# Altium project PUA.PrjPcb (part 12 of 14)

## Sheet Server_CPU_USB.SchDoc
size D
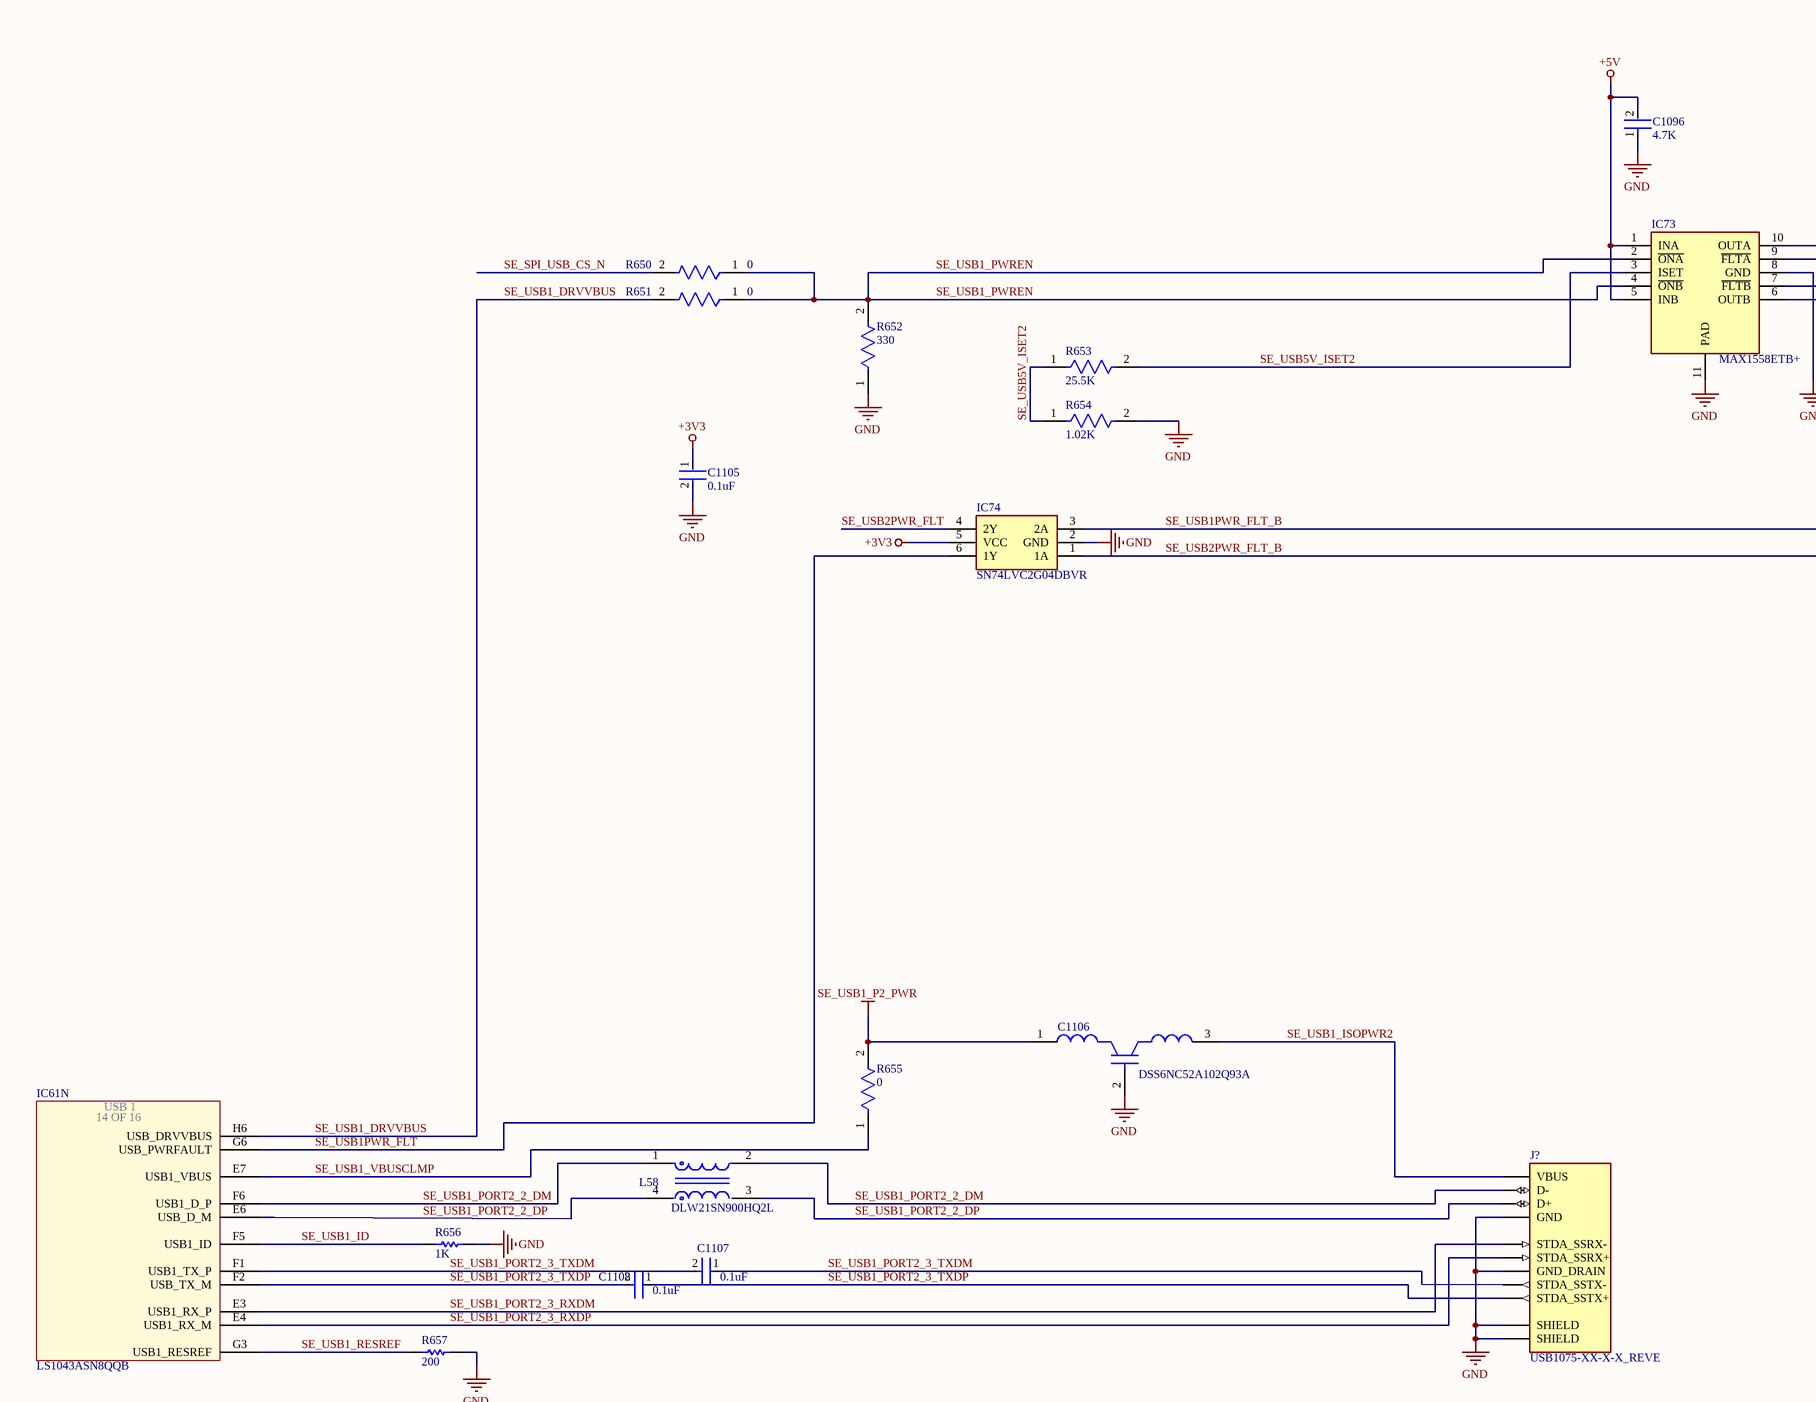
[diagram p55: Server_CPU_USB.SchDoc, top left]
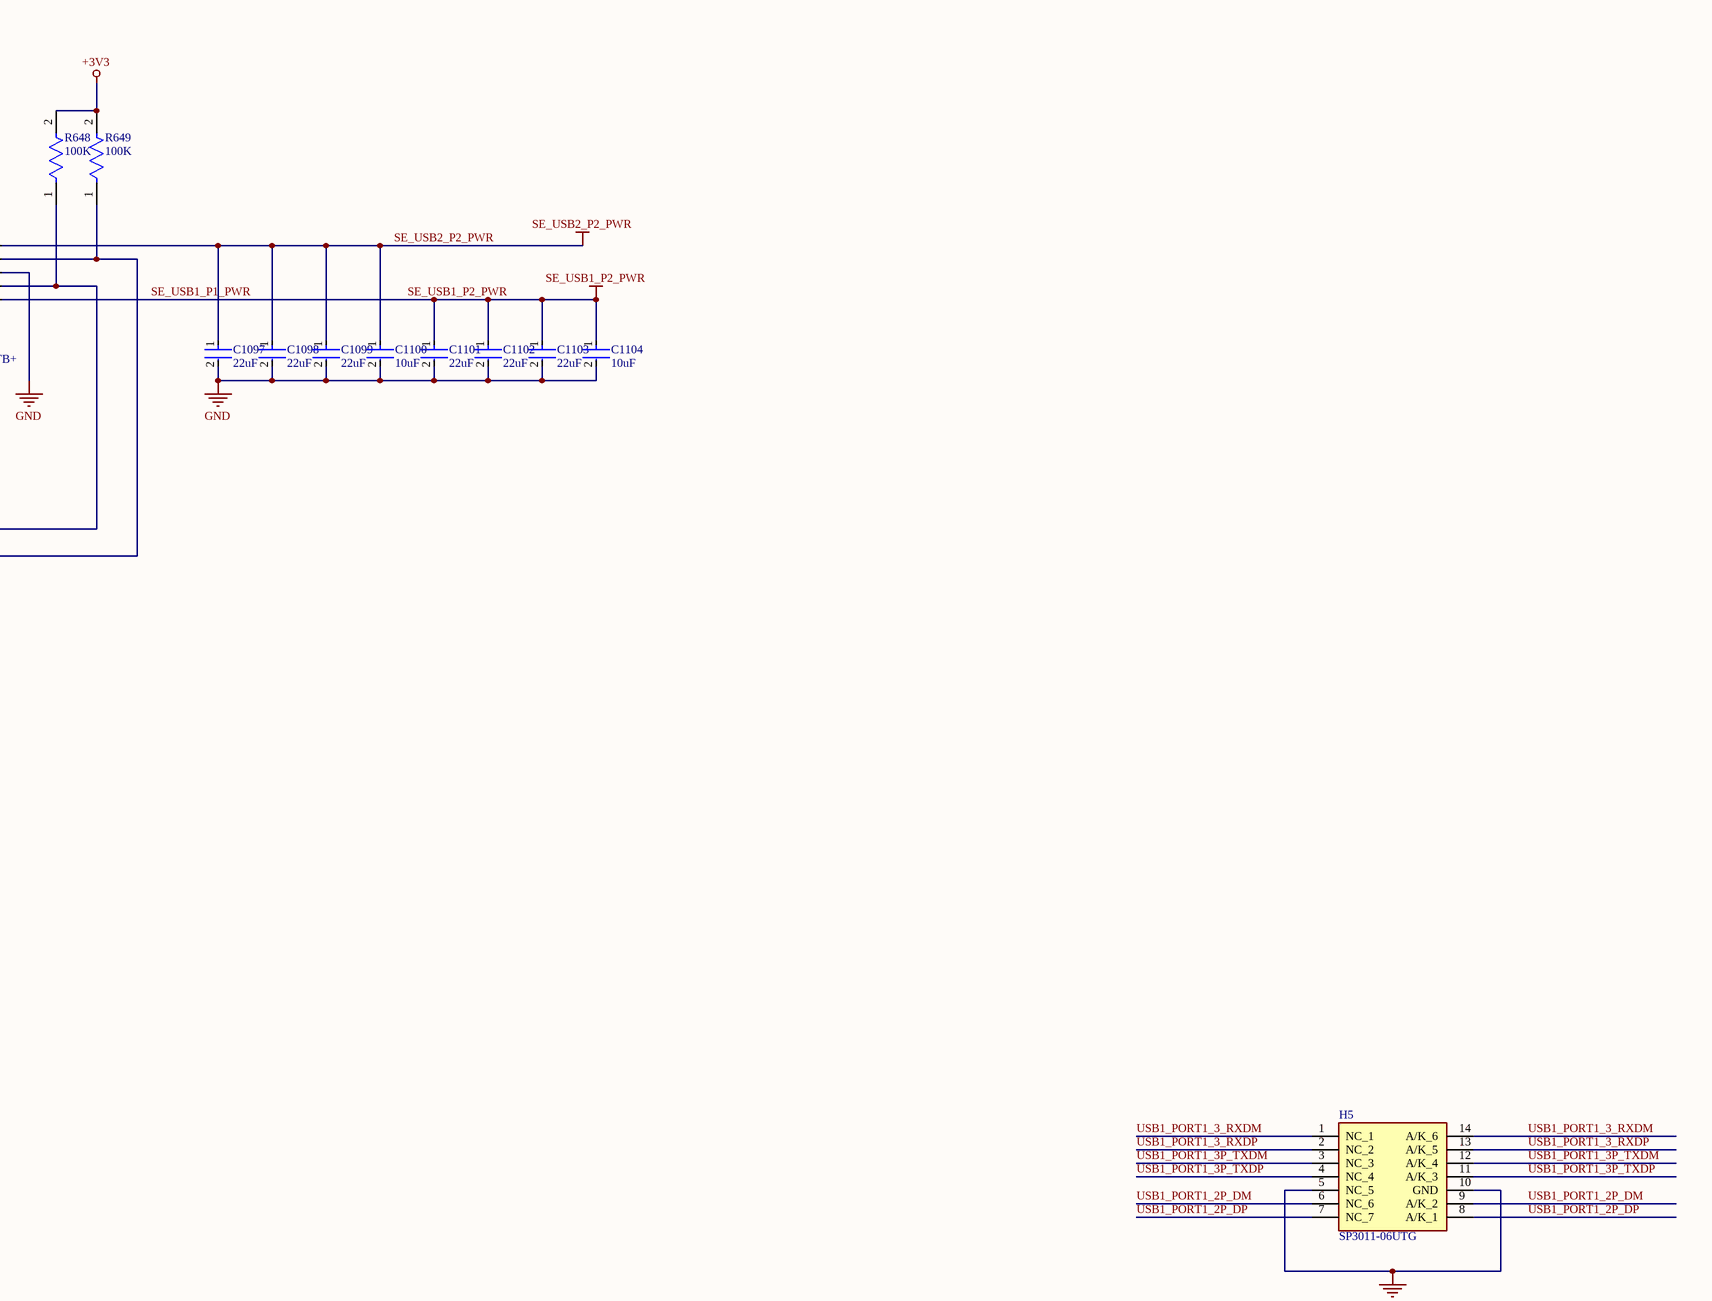
[diagram p56: Server_CPU_USB.SchDoc, top right]
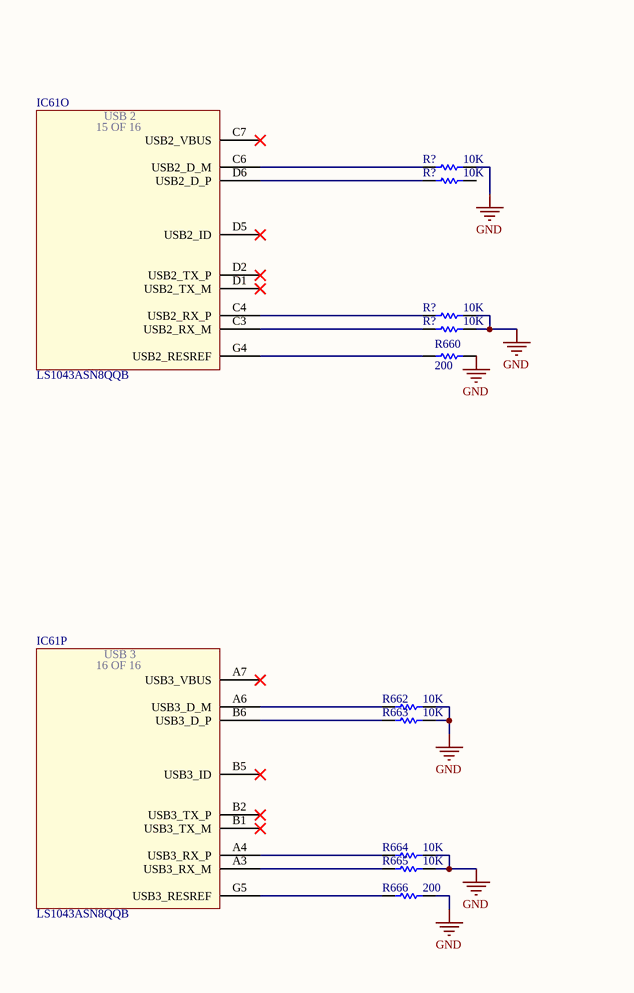
[diagram p57: Server_CPU_USB.SchDoc, bottom left]
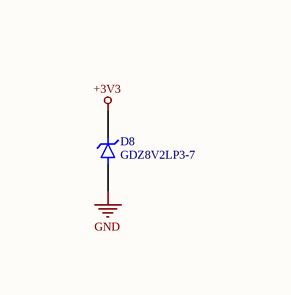
[diagram p58: Server_CPU_USB.SchDoc, bottom right]

### Parts
(Parts that share a designator on the sheet are numbered #1, #2 ... from top to bottom, then left to right.)
C1096  4.7K  [FP-GRM155-0_1-IPC_B]
C1097  22uF  [FP-GRM21B-0_15-MFG]
C1098  22uF  [FP-GRM21B-0_15-MFG]
C1099  22uF  [FP-GRM21B-0_15-MFG]
C1100  10uF  [FP-C0805C-DG-MFG]
C1101  22uF  [FP-GRM21B-0_15-MFG]
C1102  22uF  [FP-GRM21B-0_15-MFG]
C1103  22uF  [FP-GRM21B-0_15-MFG]
C1104  10uF  [FP-C0805C-DG-MFG]
C1105  0.1uF  [FP-GRM15-MFG]
C1106  DSS6NC52A102Q93A  [FP-DSS6N_Q-MFG]
C1107  0.1uF  [FP-GRM15-MFG]
C1108  0.1uF  [FP-GRM15-MFG]
D8  GDZ8V2LP3-7  [DIODFN2_62X32X35L19X24N]
H5  SP3011-06UTG  [SON50P135X350X55-14N]
IC61  LS1043ASN8QQB  [BGA780C80P28X28_2300X2300X261]  (parts N,O,P of 16)
IC73  MAX1558ETB+  [SON50P300X300X80-11N]
IC74  SN74LVC2G04DBVR  [SOT95P280X145-6N]
J?#3  USB1075-XX-X-X_REVE  [GCT_USB1075-XX-X-X_REVE]
L58  DLW21SN900HQ2L  [FP-DLW21S-MFG]
R648  100K  [FP-ERJ2RK-IPC_C]
R649  100K  [FP-ERJ2RK-IPC_C]
R650  0  [FP-CRCW0402-e3-IPC_C]
R651  0  [FP-CRCW0402-e3-IPC_C]
R652  330  [FP-CRCW0402-e3-MFG]
R653  25.5K  [FP-CRCW0402-e3-IPC_A]
R654  1.02K  [FP-CRCW0402-e3-IPC_C]
R655  0  [FP-CRCW0402-e3-IPC_C]
R656  1K  [RESC1005X40X25NL05T05]
R657  200  [RESC1005X40X25ML05T05]
R660  200  [RESC1005X40X25ML05T05]
R662  10K  [RESC1005X40X25LL05T10]
R663  10K  [RESC1005X40X25LL05T10]
R664  10K  [RESC1005X40X25LL05T10]
R665  10K  [RESC1005X40X25LL05T10]
R666  200  [RESC1005X40X25ML05T05]
R?#19  10K  [RESC1005X40X25LL05T10]
R?#20  10K  [RESC1005X40X25LL05T10]
R?#21  10K  [RESC1005X40X25LL05T10]
R?#22  10K  [RESC1005X40X25LL05T10]

### Nets
+3V3: C1105.1 D8.C IC74.5(VCC) R648.2 R649.2
+5V: C1096.2 IC73.1(INA) IC73.5(INB)
GND: C1096.1 C1097.2 C1098.2 C1099.2 C1100.2 C1101.2 C1102.2 C1103.2 C1104.2 C1105.2 C1106.2(GND) D8.A H5.5(NC_5) H5.10(GND) IC73.8(GND) IC73.11(PAD) IC74.2(GND) J?#3.4(GND) J?#3.7(GND_DRAIN) J?#3.10(SHIELD) J?#3.11(SHIELD) R652.1 R654.2 R656.2 R657.2 R660.2 R662.2 R663.2 R664.2 R665.2 R666.2 R?#19.2 R?#21.2 R?#22.2
SE_USB1_P1_PWR: C1101.1 C1102.1 C1103.1 C1104.1 C1106.1 IC73.6(OUTB) R655.2  [also labelled SE_USB1_P2_PWR]
SE_USB2_P2_PWR: C1097.1 C1098.1 C1099.1 C1100.1 IC73.10(OUTA)
SE_SPI_USB_CS_N: R650.2
SE_USB1_DRVVBUS: IC61.H6(USB_DRVVBUS) R651.2
SE_USB1_ID: IC61.F5(USB1_ID) R656.1
SE_USB1_ISOPWR2: C1106.3 J?#3.1(VBUS)
SE_USB1_PORT2_2_DM: IC61.F6(USB1_D_P) J?#3.2(D-) L58.1 L58.2
SE_USB1_PORT2_2_DP: J?#3.3(D+) L58.3
SE_USB1_PORT2_3_RXDM: IC61.E3(USB1_RX_P) J?#3.5(STDA_SSRX-)
SE_USB1_PORT2_3_RXDP: IC61.E4(USB1_RX_M) J?#3.6(STDA_SSRX+)
SE_USB1_PORT2_3_TXDM: C1107.1 C1107.2 IC61.F1(USB1_TX_P) J?#3.8(STDA_SSTX-)
SE_USB1_PORT2_3_TXDP: C1108.1 C1108.2 IC61.F2(USB_TX_M) J?#3.9(STDA_SSTX+)
SE_USB1_PWREN: IC73.2(~{ONA}) IC73.4(~{ONB}) R650.1 R651.1 R652.2
SE_USB1_RESREF: IC61.G3(USB1_RESREF) R657.1
SE_USB1_VBUSCLMP: IC61.E7(USB1_VBUS) R655.1
SE_USB1PWR_FLT: IC61.G6(USB_PWRFAULT) IC74.6(1Y)
SE_USB1PWR_FLT_B: IC73.7(~{FLTB}) IC74.3(2A) R648.1
SE_USB2PWR_FLT: IC74.4(2Y)
SE_USB2PWR_FLT_B: IC73.9(~{FLTA}) IC74.1(1A) R649.1
SE_USB5V_ISET2: IC73.3(ISET) R653.1 R653.2 R654.1
USB1_PORT1_2P_DM: H5.6(NC_6) H5.9(A/K_2)
USB1_PORT1_2P_DP: H5.7(NC_7) H5.8(A/K_1)
USB1_PORT1_3_RXDM: H5.1(NC_1) H5.14(A/K_6)
USB1_PORT1_3_RXDP: H5.2(NC_2) H5.13(A/K_5)
USB1_PORT1_3P_TXDM: H5.3(NC_3) H5.12(A/K_4)
USB1_PORT1_3P_TXDP: H5.4(NC_4) H5.11(A/K_3)
NetIC61_A3: IC61.A3(USB3_RX_M) R665.1
NetIC61_A4: IC61.A4(USB3_RX_P) R664.1
NetIC61_A6: IC61.A6(USB3_D_M) R662.1
NetIC61_B6: IC61.B6(USB3_D_P) R663.1
NetIC61_C3: IC61.C3(USB2_RX_M) R?#22.1
NetIC61_C4: IC61.C4(USB2_RX_P) R?#21.1
NetIC61_C6: IC61.C6(USB2_D_M) R?#19.1
NetIC61_D6: IC61.D6(USB2_D_P) R?#20.1
NetIC61_E6: IC61.E6(USB_D_M) L58.4
NetIC61_G4: IC61.G4(USB2_RESREF) R660.1
NetIC61_G5: IC61.G5(USB3_RESREF) R666.1

Not connected (* = marked no-connect by the designer): IC61 A7(USB3_VBUS)* B1(USB3_TX_M)* B2(USB3_TX_P)* B5(USB3_ID)* C7(USB2_VBUS)* D1(USB2_TX_M)* D2(USB2_TX_P)* D5(USB2_ID)*; R?#20 2

### Notes on the sheet
- Labels drawn without touching a wire or pin: SE_USB1_PORT2_2_DP
- Title
- Size:
- Date:
- File:
- D
- Number:
- Time:
- Revision:
- Sheet
- of
- (in symbol LS1043ASN8QQB, part N) USB 1; 14 OF 16
- (in symbol LS1043ASN8QQB, part O) USB 2; 15 OF 16
- (in symbol LS1043ASN8QQB, part P) USB 3; 16 OF 16

### Library data of the parts
C1096 = CMP-2008-04549-2: Chip Multilayer Ceramic Capacitors for General Purpose, 0402, 4.7uF, X5R, 15%, 20%, 6.3V; Height: 0.5mm; Weight: 0.000212oz; Length: 1mm; Case Code (Metric): 1005; Packaging: Tape and Reel; Termination: SMD/SMT; Dielectric: X5R; Depth: 0.5mm; Case Code (Imperial): 0402; Min Operating Temperature: -55°C; Case/Package: 0402; Voltage: 6.3V; Width: 0.02inch; Capacitance: 4.7uF; Lead Free: Lead Free; Thickness: 0.022inch; Contact Plating: Tin; REACH SVHC: No SVHC; Package Quantity: 10000; Tolerance: 20%; Voltage Rating (DC): 6.3V; Voltage Rating: 6.3V; Mount: Surface Mount; Max Operating Temperature: 85°C
C1097-C1099 C1101-C1103 = CMP-2007-03385-2: Chip Multilayer Ceramic Capacitors for General Purpose, 0805, 22uF, X5R, 15%, 20%, 6.3V; Material: Ceramic; Max Operating Temperature: 85°C; Voltage: 6.3V; Min Operating Temperature: -55°C; Case/Package: 0805; Thickness: 0.053inch; Dielectric: X5R; Packaging: Tape and Reel; Depth: 1.25mm; Termination: SMD/SMT; Voltage Rating (DC): 6.3V; Radiation Hardening: No; Tolerance: 20%; Mount: Surface Mount; Lead Free: Lead Free; Package Quantity: 1; REACH SVHC: No SVHC; Voltage Rating: 6.3V; Capacitance: 22uF; Length: 2mm; Case Code (Imperial): 0805; Case Code (Metric): 2012; Width: 0.049inch; Height: 1.25mm
C1100 C1104 = CMP-2007-03243-2: CAP CER 10UF 10V X5R 0805; Manufacturer Part Number: C0805C106K8PACTU; Manufacturer: Kemet; 3DS Part Number: 220-00001; Tolerance: 10%; Temperature Coefficient: 15%; Material: Ceramic; Device Class L2: Capacitors; Device Class L1: Passive Components; ComponentLink2URL: https://content.kemet.com/datasheets/KEM_C1006_X5R_SMD.pdf; Height: 1.4mm; Lead Free: Yes; Digikey Description: CAP CER 10UF 10V X5R 0805; Octopart: https://octopart.com/c0805c106k8pactu-kemet-98697; Capacitance: 10uF; Value: 10uF; Temperature Range Low: -55°C; Temperature: -55°C to +85°C; Automotive: No; Mouser Description: CAP CER 10UF 10V X5R 0805; Ipc Land Pattern Name: CAPC200125X125; Temperature Range High: +85°C; Voltage: 10V; RoHS: TRUE; Device Class L3: Ceramic Capacitors; ComponentLink2Description: Datasheet; Voltage Rating: 10V; Package: C0805C-DG; Temperature Characteristic: X5R; Category: Cap
C1105 C1107 C1108 = CMP-2100-03641-2: as C1078 on sheet Server_CPU_Reset_IO; RoHS: TRUE; Temperature Characteristic: X7R; Octopart: https://octopart.com/grm155r71c104ka88d-murata-196880; Digikey Description: CAP CER 0.1UF 16V X7R 0402; Device Class L3: Ceramic Capacitors; Height: 0.55mm; ComponentLink2Description: Datasheet; Temperature Range Low: -55°C; Ipc Land Pattern Name: CAPC10050X219; ComponentLink2URL: https://search.murata.co.jp/Ceramy/image/img/A01X/G101/ENG/GRM155R71H471KA01-01A.pdf; Device Class L1: Passive Components; Lead Free: yes; Category: Cap; Package: GRM15; Temperature: -55°C to +125°C; Device Class L2: Capacitors; Temperature Range High: +125°C; Mouser Description: 0402 0.1 uF 16V ±10 % Tolerance X7R SMT Multilayer Ceramic Capacitor
C1106 = CMP-06053-000338-1: Leaded 3 Terminal Capacitors 1000pF ±20% 100Vdc 6A; Capacitance: 1nF; Voltage Rating (DC): 100V; Ripple Current: 7A; Lead Free: Lead Free; Length: 8mm; Mount: Through Hole; Current Rating: 6A; Min Operating Temperature: -25°C; Width: 2.54mm; Termination: Radial; Max DC Current: 6A; Height: 10mm; Tolerance: 20%; Max Voltage Rating (DC): 100V; Package Quantity: 2000; Max Operating Temperature: 85°C; Radiation Hardening: No; Depth: 2.54mm; Packaging: Tape and Reel; Case/Package: Radial; Max Current Rating: 6A
D8 = GDZ8V2LP3-7: Diode Zener Single 8.2V 5% 250mW Automotive 2-Pin X3-DFN T/R; MF: {'manufacturer': u'Diodes Inc.'}; MP: GDZ8V2LP3-7; Value: *; Availability: Unavailable; Package: None; Price: None
H5 = SP3011-06UTG: Hardware; Manufacturer_Name: LITTELFUSE; Datasheet Link: https://datasheet.datasheetarchive.com/originals/dk/DKDS-14/271280.pdf; Height: 0.55mm; Manufacturer_Part_Number: SP3011-06UTG; Mouser Part Number: 576-SP3011-06UTG; Mouser Price/Stock: https://www.mouser.co.uk/ProductDetail/Littelfuse/SP3011-06UTG?qs=K%252BkT2xeNSS3A727KwWw2sg%3D%3D; Arrow Part Number: SP3011-06UTG; Arrow Price/Stock: https://www.arrow.com/en/products/sp3011-06utg/littelfuse
IC61 = LS1043ASN8QQB: as IC61 on sheet Server_CPU_Reset_IO; Datasheet Link: http://www.nxp.com/secured/assets/documents/en/data-sheet/LS1088A.pdf; Height: 2.61mm; Manufacturer_Part_Number: LS1043ASN8QQB; Mouser Part Number: 771-LS1043ASN8QQB; Mouser Price/Stock: https://www.mouser.co.uk/ProductDetail/NXP-Semiconductors/LS1043ASN8QQB/?qs=AQlKX63v8RsTATOTx7X0Jg%3D%3D
IC73 = MAX1558ETB+: Integrated Circuit; Manufacturer_Name: Maxim Integrated; Datasheet Link: https://datasheets.maximintegrated.com/en/ds/MAX1558-MAX1558H.pdf; Height: 0.8mm; Manufacturer_Part_Number: MAX1558ETB+
IC74 = SN74LVC2G04DBVR: Integrated Circuit; Manufacturer_Name: Texas Instruments; Datasheet Link: http://www.ti.com/lit/gpn/sn74lvc2g04; Height: 1.45mm; Manufacturer_Part_Number: SN74LVC2G04DBVR; Mouser Part Number: 595-SN74LVC2G04DBVR; Mouser Price/Stock: https://www.mouser.co.uk/ProductDetail/Texas-Instruments/SN74LVC2G04DBVR?qs=HE9hdJajmeqXJJ9RII89dg%3D%3D; Arrow Part Number: SN74LVC2G04DBVR; Arrow Price/Stock: https://www.arrow.com/en/products/sn74lvc2g04dbvr/texas-instruments
J?#3 = USB1075-XX-X-X_REVE: USB 3.0 Receptacle. Type A, Through Hole, Horizontal, 9 Pin, Top Mount, with Kinked Shelll Stakes; MF: {'manufacturer': u'Global Connector Technology'}; Availability: Unavailable; MP: USB1075-XX-X-X_REVE; Value: *; Package: None; Price: None
L58 = CMP-2000-06163-2: Common Mode Choke, 0805, 90Ω @ 100MHz, 0.41Ω, 25%, 280mA; Impedance: 90R; Shielding: Unshielded; DC Resistance (DCR): 410mR; Number of Lines: 2; RoHS Compliant: Yes; Series: EMIFIL®, DLW21S; Weight: 0.000388oz; Current Rating: 280mA; Case Code (Imperial): 0805; Termination: SMD/SMT; Lead Free: Lead Free; Width: 0.047inch; Height: 0.055inch; Package Quantity: 1; Radiation Hardening: No; Depth: 1.4mm; Packaging: Tape and Reel; Current: 280mA; REACH SVHC: No SVHC; Test Frequency: 100MHz; DC Current: 280mA; Max Operating Temperature: 85°C; Case/Package: 0805; Min Operating Temperature: -40°C; Max DC Current: 280mA; Tolerance: 25%; Resistor Type: Wirewound; Length: 2mm; Mount: Surface Mount; Military Standard: Not
R648 R649 = CMP-2002-00608-4: RES SMD 100K OHM 1% 1/10W 0402; Resistance: 100kR; Voltage Rating (DC): 50V; Power Rating: 100mW; Temperature Coefficient: 100ppm/°C; Case/Package: 0402; Length: 1mm; Package Quantity: 1; Radiation Hardening: No; Case Code (Metric): 1005; Contact Plating: Tin; Mount: Surface Mount; Depth: 0.5mm; Max Operating Temperature: 155°C; Lead Free: Lead Free; Width: 0.5mm; Composition: Thick Film; Case Code (Imperial): 0402; Tolerance: 1%; Termination: SMD/SMT; Number of Pins: 2; Height: 0.35mm; Voltage Rating: 50V; Military Standard: Not; REACH SVHC: No SVHC; Packaging: Tape and Reel; Min Operating Temperature: -55°C; Max Power Dissipation: 100mW; Features: Automotive AEC-Q200; Number of Terminations: 2
R650 R651 R655 = CMP-2002-08122-2: as R553 on sheet Server_CPU_Reset_IO; Contact Plating: Tin; Height: 0.35mm; Radiation Hardening: No; Features: Automotive AEC-Q200; Composition: Thick Film; Width: 0.5mm; Weight: 2.3E-05oz; Termination: SMD/SMT; Packaging: Tape and Reel; Mount: Surface Mount; Case Code (Metric): 1005; Military Standard: Not; Min Operating Temperature: -55°C; Number of Terminations: 2; Package Quantity: 1; Case Code (Imperial): 0402; Depth: 0.5mm; Max Operating Temperature: 155°C; Case/Package: 0402; Power Rating: 63mW; Lead Free: Lead Free; Voltage Rating (DC): 50V; Length: 1mm
R652 = CMP-2002-08523-2: as R584 on sheet Server_CPU_Reset_IO; Case/Package: 0402; Packaging: Tape and Reel; Width: 0.5mm; Case Code (Metric): 1005; Radiation Hardening: No; Military Standard: Not; Contact Plating: Tin; Temperature Coefficient: 100ppm/°C; Lead Free: Lead Free; Power Rating: 63mW; Voltage Rating: 50V; Tolerance: 1%; Features: Automotive AEC-Q200; Case Code (Imperial): 0402; Composition: Thick Film; Weight: 2.3E-05oz; Package Quantity: 10; Min Operating Temperature: -55°C; Height: 0.35mm; Length: 1mm; Termination: SMD/SMT; Number of Terminations: 2; Depth: 0.5mm; Max Operating Temperature: 155°C
R653 = CMP-2002-08416-2: RES Thick Film, 25.5kΩ, 1%, 0.063W, 100ppm/°C, 0402; Power Rating: 63mW; Voltage Rating: 50V; Resistance: 25.5kR; Number of Terminations: 2; Length: 1mm; Height: 0.35mm; Termination: SMD/SMT; Radiation Hardening: No; Min Operating Temperature: -55°C; Lead Free: Lead Free; Number of Pins: 2; Mount: Surface Mount; Temperature Coefficient: 100ppm/°C; Weight: 2.3E-05oz; Composition: Thick Film; Depth: 0.5mm; Tolerance: 1%; Width: 0.5mm; Contact Plating: Tin; Features: Automotive AEC-Q200; Max Operating Temperature: 155°C; Case Code (Metric): 1005; Military Standard: Not; Packaging: Tape and Reel; Voltage Rating (DC): 50V; Package Quantity: 10; Case/Package: 0402; Max Power Dissipation: 63mW; Case Code (Imperial): 0402
R654 = CMP-2002-08279-2: RES Thick Film, 1.02kΩ, 1%, 0.063W, 100ppm/°C, 0402; Resistance: 1.02kR; Voltage Rating: 50V; Max Power Dissipation: 63mW; Features: Automotive AEC-Q200; Composition: Thick Film; Termination: SMD/SMT; Number of Terminations: 2; Contact Plating: Tin; Case Code (Imperial): 0402; Width: 0.02inch; Weight: 2.3E-05oz; Case Code (Metric): 1005; Lead Free: Lead Free; Length: 1mm; Packaging: Tape and Reel; Radiation Hardening: No; Case/Package: 0402; Number of Pins: 2; Voltage Rating (DC): 50V; Min Operating Temperature: -55°C; Tolerance: 1%; Package Quantity: 10; Height: 0.016inch; Max Operating Temperature: 155°C; Temperature Coefficient: 100ppm/°C; Depth: 0.5mm; Military Standard: Not; Power Rating: 63mW
R656 = CMP-2002-00432-1: Manufacturer: Panasonic; Part Number: ERJ-2GEJ102X
R657 R660 R666 = CMP-2002-08353-1: Part Number: CRCW0402200RJNED; Manufacturer: Vishay Dale
R662-R665 R?#19-R?#22 = CMP-2002-07353-1: Part Number: RC0402FR-0710KL; Manufacturer: Yageo / Phycomp

## Sheet Server_CPU_DDR4.SchDoc
size D
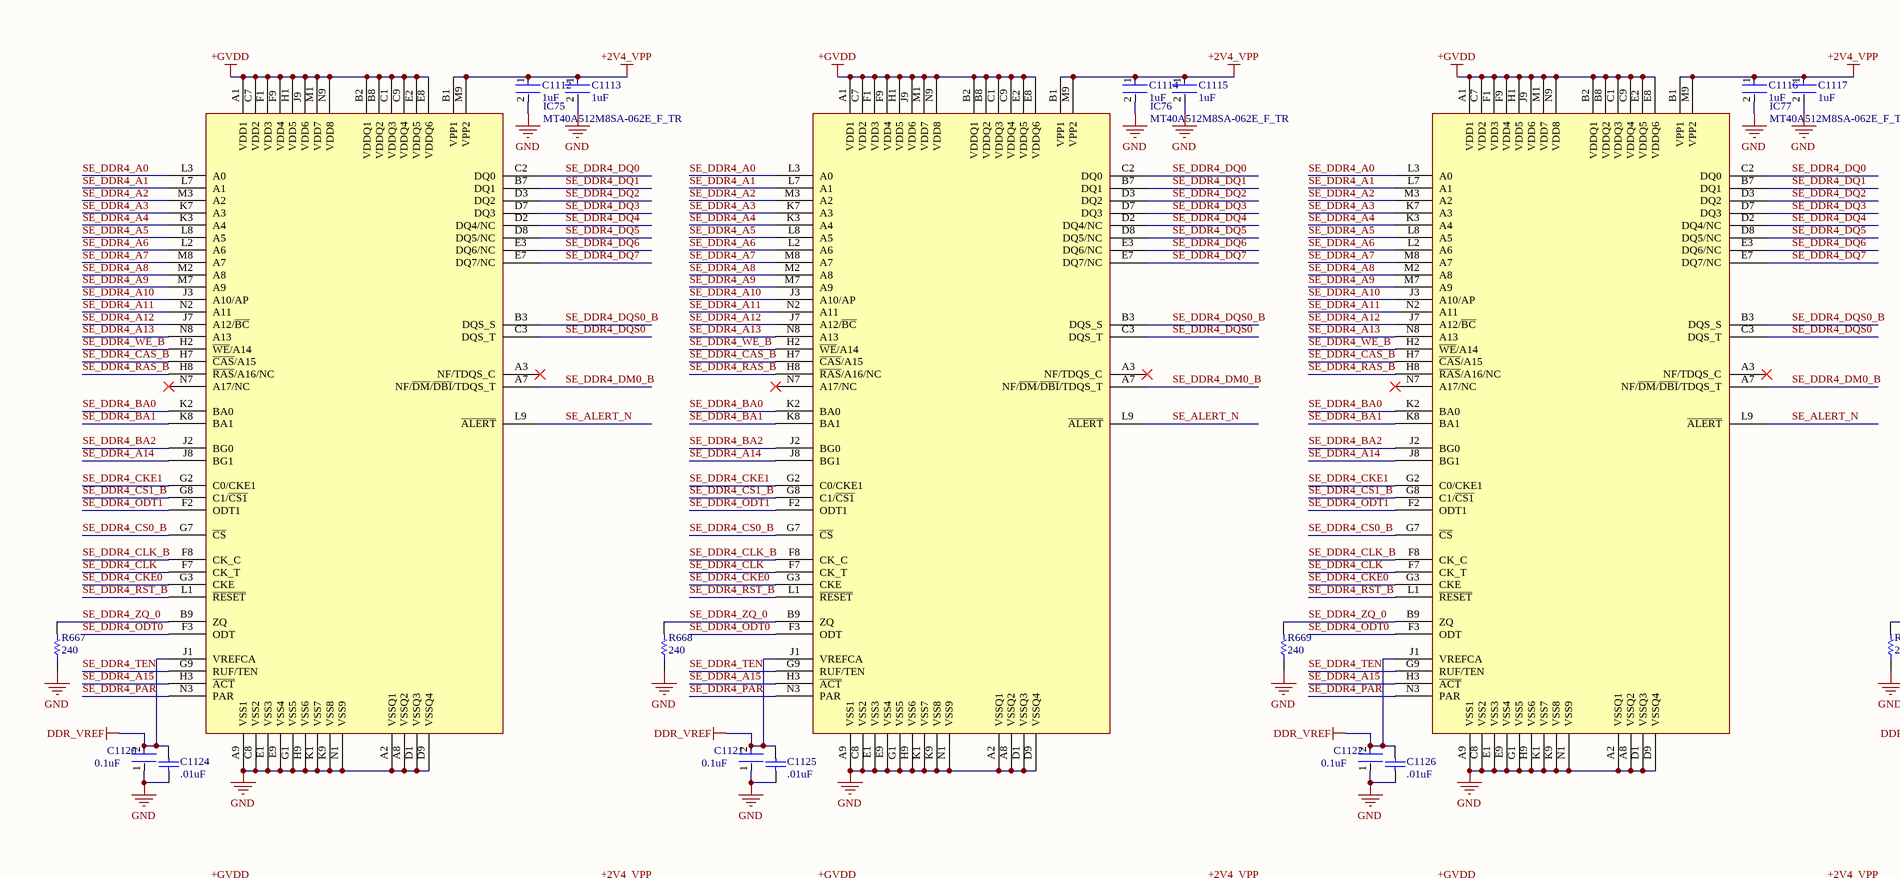
[diagram p59: Server_CPU_DDR4.SchDoc, top left]
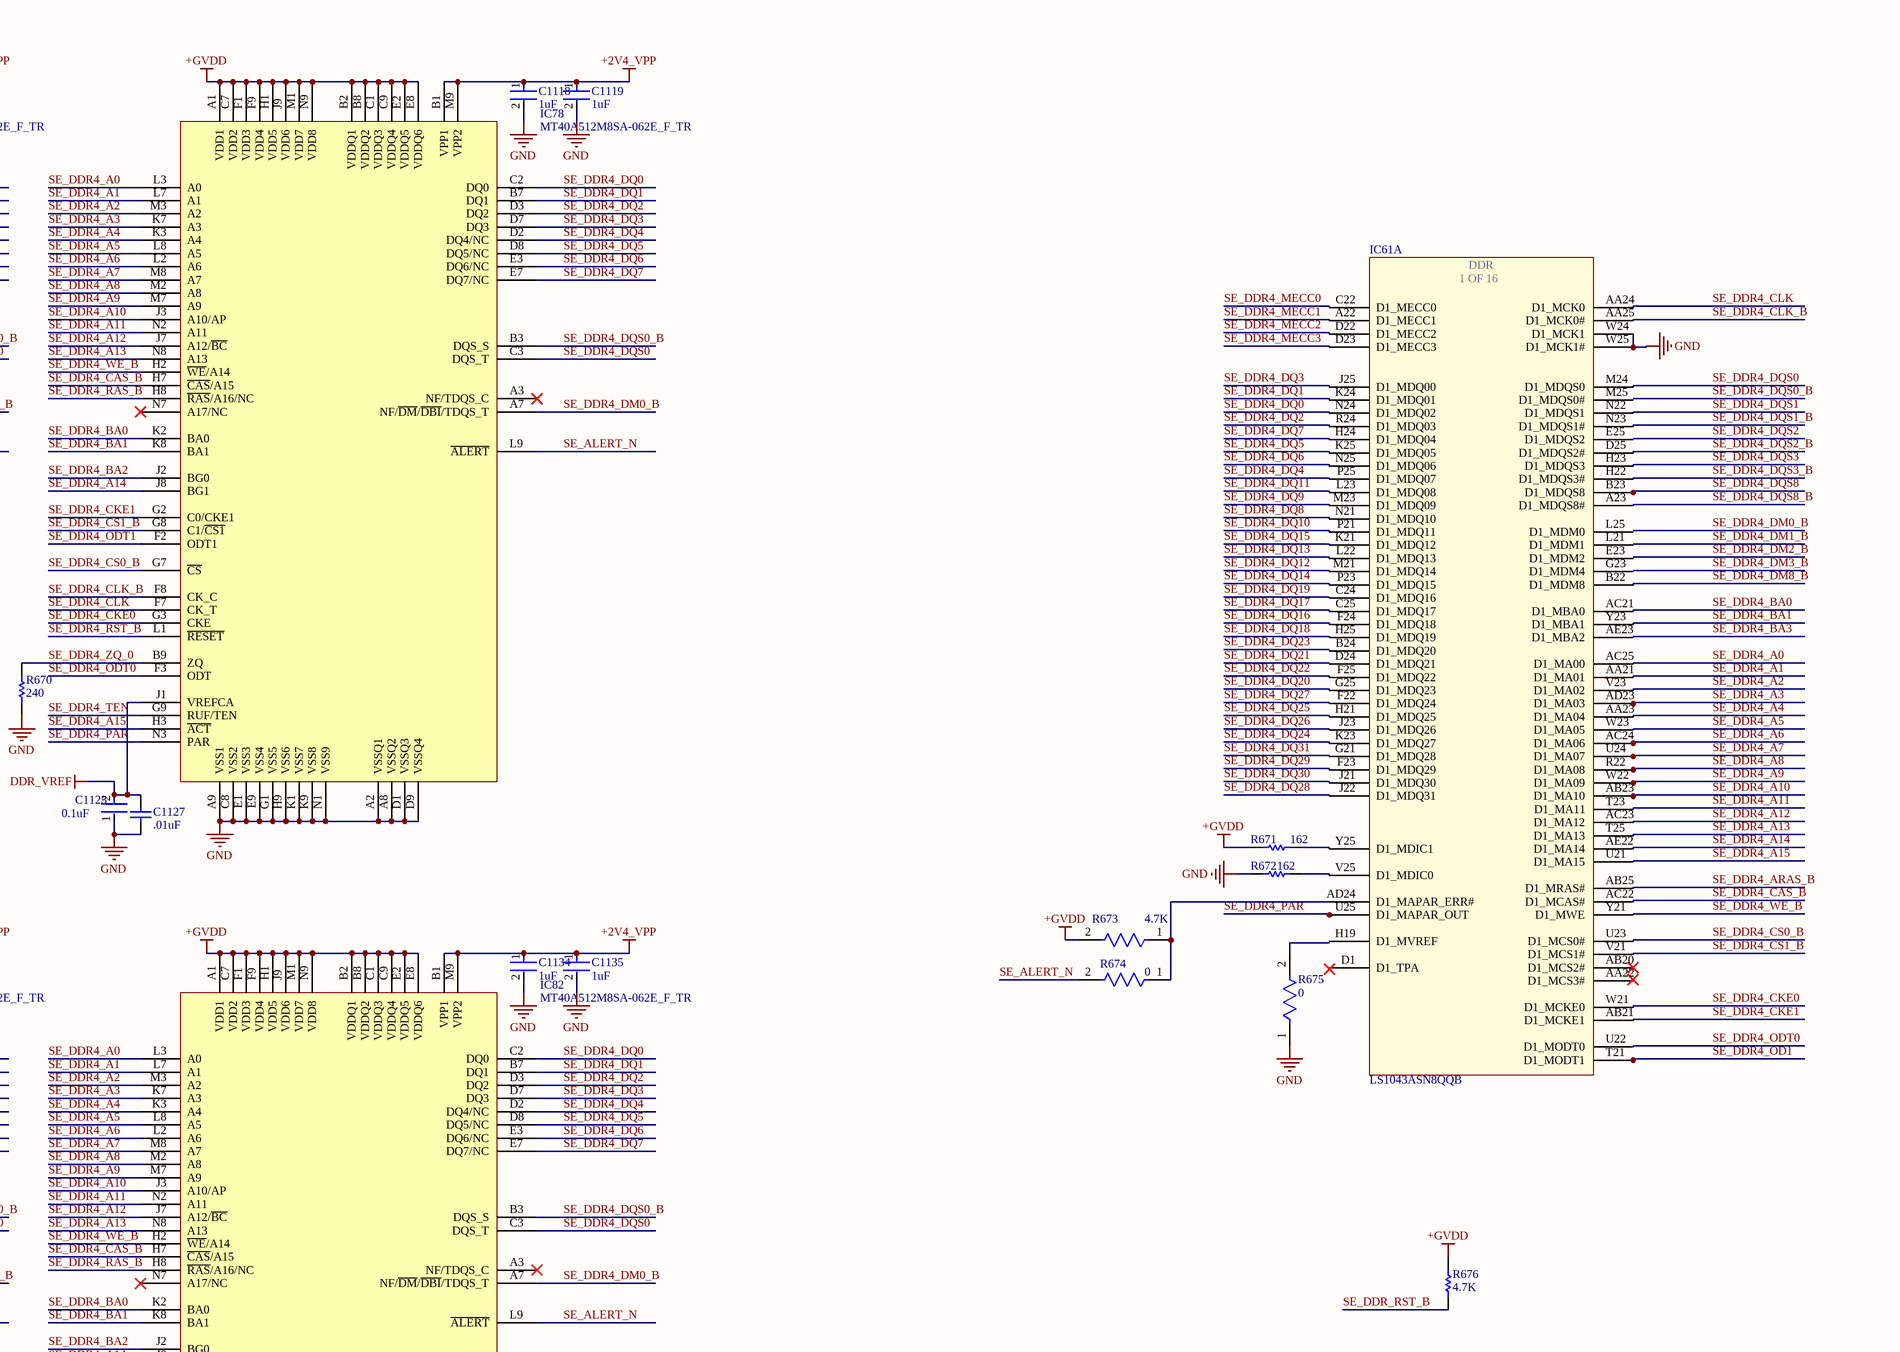
[diagram p60: Server_CPU_DDR4.SchDoc, top right]
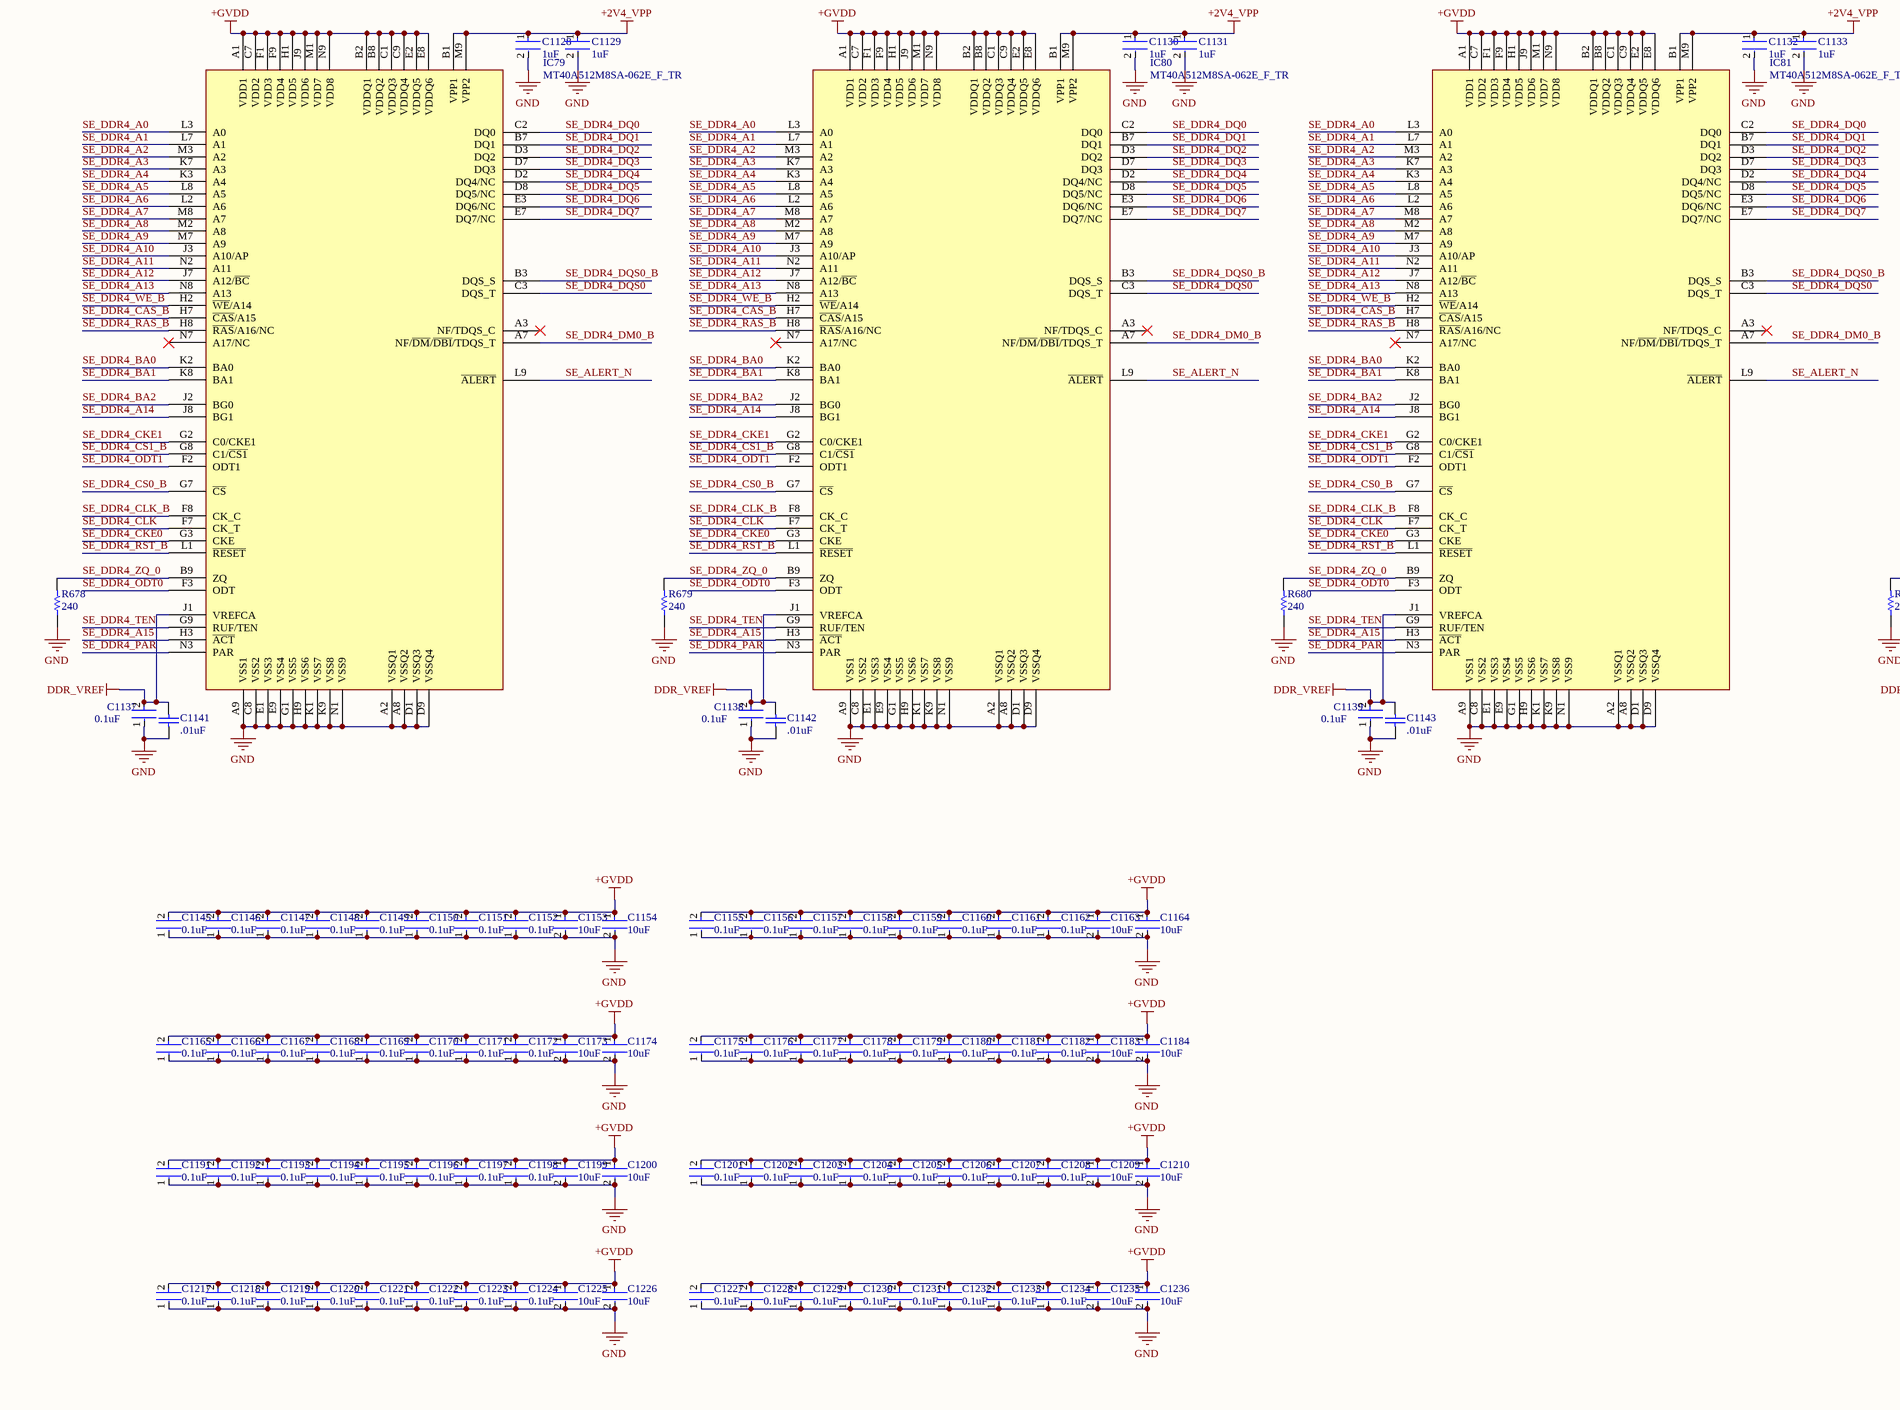
[diagram p61: Server_CPU_DDR4.SchDoc, bottom left]
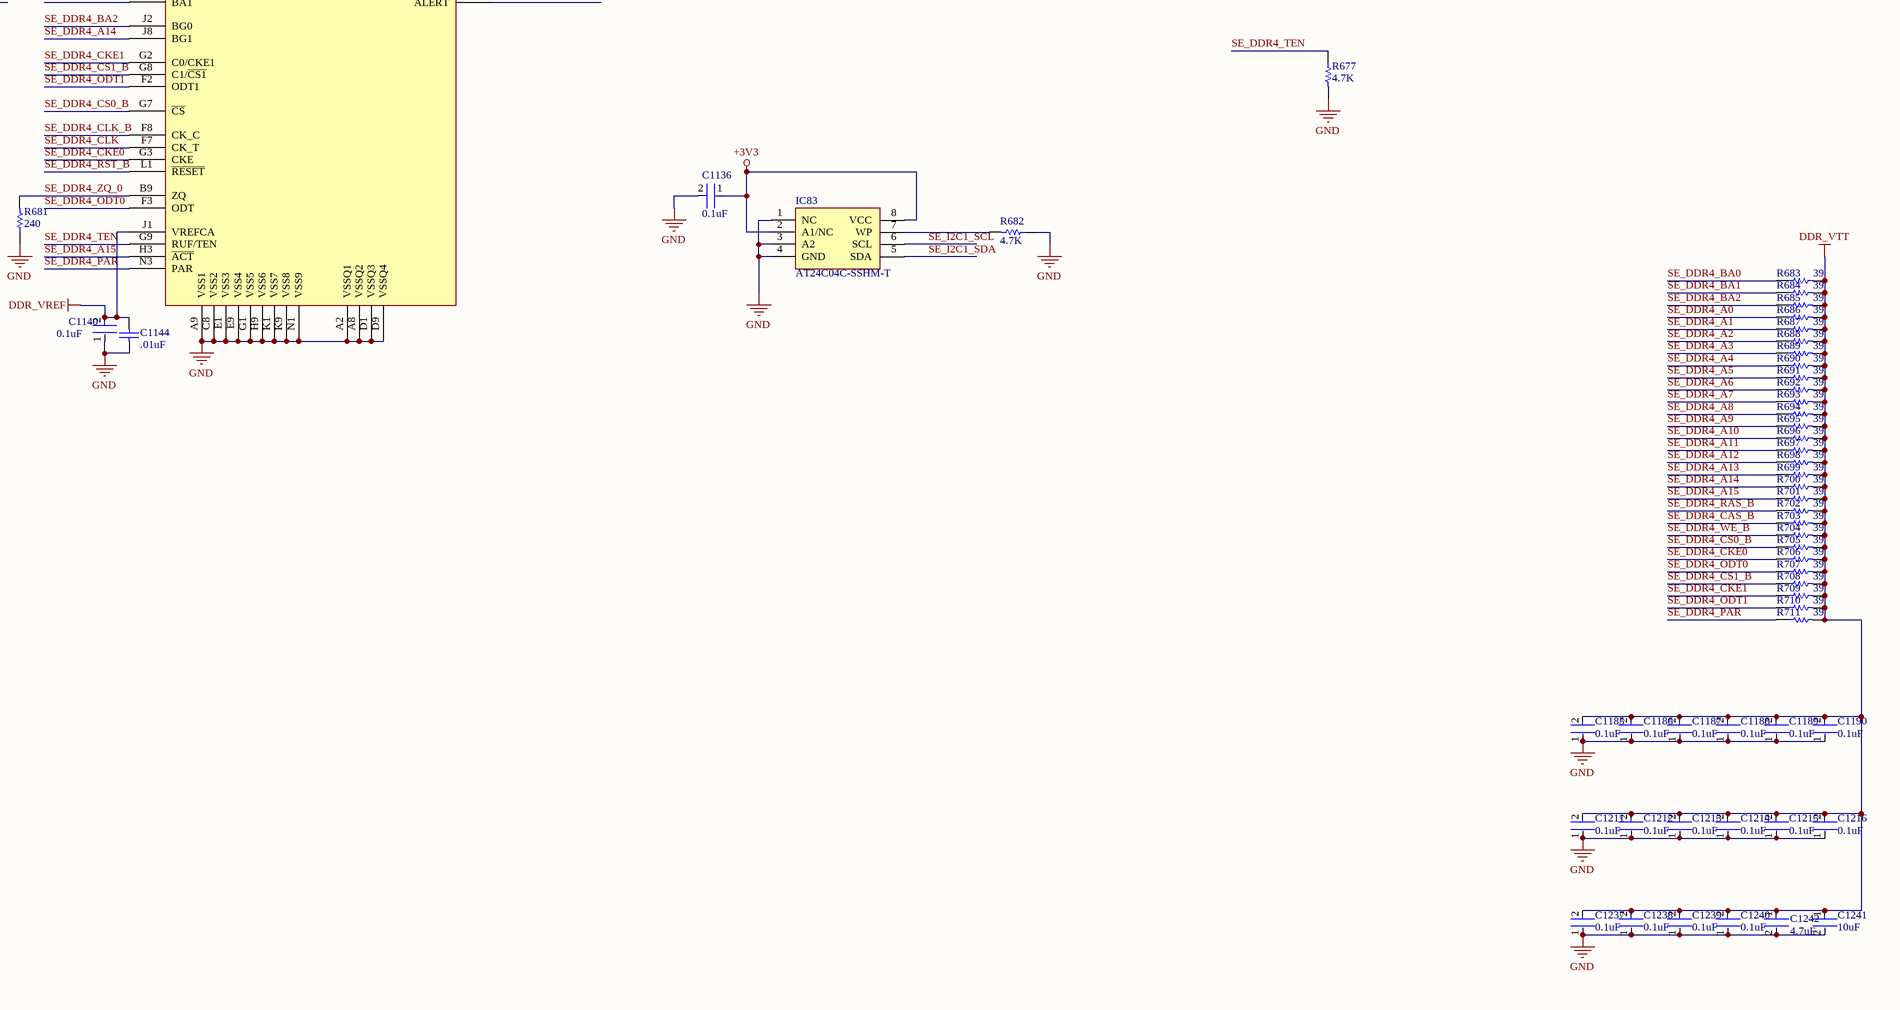
[diagram p62: Server_CPU_DDR4.SchDoc, bottom right]

### Parts
C1112  1uF  [FP-GRM15-0_1-MFG]
C1113  1uF  [FP-GRM15-0_1-MFG]
C1114  1uF  [FP-GRM15-0_1-MFG]
C1115  1uF  [FP-GRM15-0_1-MFG]
C1116  1uF  [FP-GRM15-0_1-MFG]
C1117  1uF  [FP-GRM15-0_1-MFG]
C1118  1uF  [FP-GRM15-0_1-MFG]
C1119  1uF  [FP-GRM15-0_1-MFG]
C1120  0.1uF  [FP-GRM15-MFG]
C1121  0.1uF  [FP-GRM15-MFG]
C1122  0.1uF  [FP-GRM15-MFG]
C1123  0.1uF  [FP-GRM15-MFG]
C1124  .01uF  [CAPC1005X56X25LL10T15]
C1125  .01uF  [CAPC1005X56X25LL10T15]
C1126  .01uF  [CAPC1005X56X25LL10T15]
C1127  .01uF  [CAPC1005X56X25LL10T15]
C1128  1uF  [FP-GRM15-0_1-MFG]
C1129  1uF  [FP-GRM15-0_1-MFG]
C1130  1uF  [FP-GRM15-0_1-MFG]
C1131  1uF  [FP-GRM15-0_1-MFG]
C1132  1uF  [FP-GRM15-0_1-MFG]
C1133  1uF  [FP-GRM15-0_1-MFG]
C1134  1uF  [FP-GRM15-0_1-MFG]
C1135  1uF  [FP-GRM15-0_1-MFG]
C1136  0.1uF  [FP-GRM15-MFG]
C1137  0.1uF  [FP-GRM15-MFG]
C1138  0.1uF  [FP-GRM15-MFG]
C1139  0.1uF  [FP-GRM15-MFG]
C1140  0.1uF  [FP-GRM15-MFG]
C1141  .01uF  [CAPC1005X56X25LL10T15]
C1142  .01uF  [CAPC1005X56X25LL10T15]
C1143  .01uF  [CAPC1005X56X25LL10T15]
C1144  .01uF  [CAPC1005X56X25LL10T15]
C1145  0.1uF  [FP-GRM15-MFG]
C1146  0.1uF  [FP-GRM15-MFG]
C1147  0.1uF  [FP-GRM15-MFG]
C1148  0.1uF  [FP-GRM15-MFG]
C1149  0.1uF  [FP-GRM15-MFG]
C1150  0.1uF  [FP-GRM15-MFG]
C1151  0.1uF  [FP-GRM15-MFG]
C1152  0.1uF  [FP-GRM15-MFG]
C1153  10uF  [FP-GRM21B-0_1-IPC_C]
C1154  10uF  [FP-GRM21B-0_1-IPC_C]
C1155  0.1uF  [FP-GRM15-MFG]
C1156  0.1uF  [FP-GRM15-MFG]
C1157  0.1uF  [FP-GRM15-MFG]
C1158  0.1uF  [FP-GRM15-MFG]
C1159  0.1uF  [FP-GRM15-MFG]
C1160  0.1uF  [FP-GRM15-MFG]
C1161  0.1uF  [FP-GRM15-MFG]
C1162  0.1uF  [FP-GRM15-MFG]
C1163  10uF  [FP-GRM21B-0_1-IPC_C]
C1164  10uF  [FP-GRM21B-0_1-IPC_C]
C1165  0.1uF  [FP-GRM15-MFG]
C1166  0.1uF  [FP-GRM15-MFG]
C1167  0.1uF  [FP-GRM15-MFG]
C1168  0.1uF  [FP-GRM15-MFG]
C1169  0.1uF  [FP-GRM15-MFG]
C1170  0.1uF  [FP-GRM15-MFG]
C1171  0.1uF  [FP-GRM15-MFG]
C1172  0.1uF  [FP-GRM15-MFG]
C1173  10uF  [FP-GRM21B-0_1-IPC_C]
C1174  10uF  [FP-GRM21B-0_1-IPC_C]
C1175  0.1uF  [FP-GRM15-MFG]
C1176  0.1uF  [FP-GRM15-MFG]
C1177  0.1uF  [FP-GRM15-MFG]
C1178  0.1uF  [FP-GRM15-MFG]
C1179  0.1uF  [FP-GRM15-MFG]
C1180  0.1uF  [FP-GRM15-MFG]
C1181  0.1uF  [FP-GRM15-MFG]
C1182  0.1uF  [FP-GRM15-MFG]
C1183  10uF  [FP-GRM21B-0_1-IPC_C]
C1184  10uF  [FP-GRM21B-0_1-IPC_C]
C1185  0.1uF  [FP-GRM15-MFG]
C1186  0.1uF  [FP-GRM15-MFG]
C1187  0.1uF  [FP-GRM15-MFG]
C1188  0.1uF  [FP-GRM15-MFG]
C1189  0.1uF  [FP-GRM15-MFG]
C1190  0.1uF  [FP-GRM15-MFG]
C1191  0.1uF  [FP-GRM15-MFG]
C1192  0.1uF  [FP-GRM15-MFG]
C1193  0.1uF  [FP-GRM15-MFG]
C1194  0.1uF  [FP-GRM15-MFG]
C1195  0.1uF  [FP-GRM15-MFG]
C1196  0.1uF  [FP-GRM15-MFG]
C1197  0.1uF  [FP-GRM15-MFG]
C1198  0.1uF  [FP-GRM15-MFG]
C1199  10uF  [FP-GRM21B-0_1-IPC_C]
C1200  10uF  [FP-GRM21B-0_1-IPC_C]
C1201  0.1uF  [FP-GRM15-MFG]
C1202  0.1uF  [FP-GRM15-MFG]
C1203  0.1uF  [FP-GRM15-MFG]
C1204  0.1uF  [FP-GRM15-MFG]
C1205  0.1uF  [FP-GRM15-MFG]
C1206  0.1uF  [FP-GRM15-MFG]
C1207  0.1uF  [FP-GRM15-MFG]
C1208  0.1uF  [FP-GRM15-MFG]
C1209  10uF  [FP-GRM21B-0_1-IPC_C]
C1210  10uF  [FP-GRM21B-0_1-IPC_C]
C1211  0.1uF  [FP-GRM15-MFG]
C1212  0.1uF  [FP-GRM15-MFG]
C1213  0.1uF  [FP-GRM15-MFG]
C1214  0.1uF  [FP-GRM15-MFG]
C1215  0.1uF  [FP-GRM15-MFG]
C1216  0.1uF  [FP-GRM15-MFG]
C1217  0.1uF  [FP-GRM15-MFG]
C1218  0.1uF  [FP-GRM15-MFG]
C1219  0.1uF  [FP-GRM15-MFG]
C1220  0.1uF  [FP-GRM15-MFG]
C1221  0.1uF  [FP-GRM15-MFG]
C1222  0.1uF  [FP-GRM15-MFG]
C1223  0.1uF  [FP-GRM15-MFG]
C1224  0.1uF  [FP-GRM15-MFG]
C1225  10uF  [FP-GRM21B-0_1-IPC_C]
C1226  10uF  [FP-GRM21B-0_1-IPC_C]
C1227  0.1uF  [FP-GRM15-MFG]
C1228  0.1uF  [FP-GRM15-MFG]
C1229  0.1uF  [FP-GRM15-MFG]
C1230  0.1uF  [FP-GRM15-MFG]
C1231  0.1uF  [FP-GRM15-MFG]
C1232  0.1uF  [FP-GRM15-MFG]
C1233  0.1uF  [FP-GRM15-MFG]
C1234  0.1uF  [FP-GRM15-MFG]
C1235  10uF  [FP-GRM21B-0_1-IPC_C]
C1236  10uF  [FP-GRM21B-0_1-IPC_C]
C1237  0.1uF  [FP-GRM15-MFG]
C1238  0.1uF  [FP-GRM15-MFG]
C1239  0.1uF  [FP-GRM15-MFG]
C1240  0.1uF  [FP-GRM15-MFG]
C1241  10uF  [FP-GRM21B-0_1-IPC_C]
C1242  4.7uF  [FP-GRM155-0_1-IPC_B]
IC61  LS1043ASN8QQB  [BGA780C80P28X28_2300X2300X261]  (part A of 16)
IC75  MT40A512M8SA-062E_F_TR  [BGA78C80P9X13_750X1100X120]
IC76  MT40A512M8SA-062E_F_TR  [BGA78C80P9X13_750X1100X120]
IC77  MT40A512M8SA-062E_F_TR  [BGA78C80P9X13_750X1100X120]
IC78  MT40A512M8SA-062E_F_TR  [BGA78C80P9X13_750X1100X120]
IC79  MT40A512M8SA-062E_F_TR  [BGA78C80P9X13_750X1100X120]
IC80  MT40A512M8SA-062E_F_TR  [BGA78C80P9X13_750X1100X120]
IC81  MT40A512M8SA-062E_F_TR  [BGA78C80P9X13_750X1100X120]
IC82  MT40A512M8SA-062E_F_TR  [BGA78C80P9X13_750X1100X120]
IC83  AT24C04C-SSHM-T  [SOIC127P600X175-8N]
R667  240  [RESC1005X40X25ML05T05]
R668  240  [RESC1005X40X25ML05T05]
R669  240  [RESC1005X40X25ML05T05]
R670  240  [RESC1005X40X25ML05T05]
R671  162  [RESC1005X40X25LL05T05]
R672  162  [RESC1005X40X25LL05T05]
R673  4.7K  [FP-CRCW0402-e3-IPC_B]
R674  0  [FP-CRCW0402-e3-IPC_C]
R675  0  [FP-CRCW0402-e3-IPC_C]
R676  4.7K  [RESC1005X40X25LL05T05]
R677  4.7K  [RESC1005X40X25LL05T05]
R678  240  [RESC1005X40X25ML05T05]
R679  240  [RESC1005X40X25ML05T05]
R680  240  [RESC1005X40X25ML05T05]
R681  240  [RESC1005X40X25ML05T05]
R682  4.7K  [RESC1005X40X25LL05T05]
R683  39  [RESC1005X40X25LL05T05]
R684  39  [RESC1005X40X25LL05T05]
R685  39  [RESC1005X40X25LL05T05]
R686  39  [RESC1005X40X25LL05T05]
R687  39  [RESC1005X40X25LL05T05]
R688  39  [RESC1005X40X25LL05T05]
R689  39  [RESC1005X40X25LL05T05]
R690  39  [RESC1005X40X25LL05T05]
R691  39  [RESC1005X40X25LL05T05]
R692  39  [RESC1005X40X25LL05T05]
R693  39  [RESC1005X40X25LL05T05]
R694  39  [RESC1005X40X25LL05T05]
R695  39  [RESC1005X40X25LL05T05]
R696  39  [RESC1005X40X25LL05T05]
R697  39  [RESC1005X40X25LL05T05]
R698  39  [RESC1005X40X25LL05T05]
R699  39  [RESC1005X40X25LL05T05]
R700  39  [RESC1005X40X25LL05T05]
R701  39  [RESC1005X40X25LL05T05]
R702  39  [RESC1005X40X25LL05T05]
R703  39  [RESC1005X40X25LL05T05]
R704  39  [RESC1005X40X25LL05T05]
R705  39  [RESC1005X40X25LL05T05]
R706  39  [RESC1005X40X25LL05T05]
R707  39  [RESC1005X40X25LL05T05]
R708  39  [RESC1005X40X25LL05T05]
R709  39  [RESC1005X40X25LL05T05]
R710  39  [RESC1005X40X25LL05T05]
R711  39  [RESC1005X40X25LL05T05]

### Nets
+2V4_VPP: C1112.1 C1113.1 C1114.1 C1115.1 C1116.1 C1117.1 C1118.1 C1119.1 C1128.1 C1129.1 C1130.1 C1131.1 C1132.1 C1133.1 C1134.1 C1135.1 IC75.B1(VPP1) IC75.M9(VPP2) IC76.B1(VPP1) IC76.M9(VPP2) IC77.B1(VPP1) IC77.M9(VPP2) IC78.B1(VPP1) IC78.M9(VPP2) IC79.B1(VPP1) IC79.M9(VPP2) IC80.B1(VPP1) IC80.M9(VPP2) IC81.B1(VPP1) IC81.M9(VPP2) IC82.B1(VPP1) IC82.M9(VPP2)
+3V3: C1136.1 IC83.2(A1/NC) IC83.8(VCC)
+GVDD: C1145.2 C1146.2 C1147.2 C1148.2 C1149.2 C1150.2 C1151.2 C1152.2 C1153.1 C1154.1 C1155.2 C1156.2 C1157.2 C1158.2 C1159.2 C1160.2 C1161.2 C1162.2 C1163.1 C1164.1 C1165.2 C1166.2 C1167.2 C1168.2 C1169.2 C1170.2 C1171.2 C1172.2 C1173.1 C1174.1 C1175.2 C1176.2 C1177.2 C1178.2 C1179.2 C1180.2 C1181.2 C1182.2 C1183.1 C1184.1 C1191.2 C1192.2 C1193.2 C1194.2 C1195.2 C1196.2 C1197.2 C1198.2 C1199.1 C1200.1 C1201.2 C1202.2 C1203.2 C1204.2 C1205.2 C1206.2 C1207.2 C1208.2 C1209.1 C1210.1 C1217.2 C1218.2 C1219.2 C1220.2 C1221.2 C1222.2 C1223.2 C1224.2 C1225.1 C1226.1 C1227.2 C1228.2 C1229.2 C1230.2 C1231.2 C1232.2 C1233.2 C1234.2 C1235.1 C1236.1 IC75.A1(VDD1) IC75.B2(VDDQ1) IC75.B8(VDDQ2) IC75.C1(VDDQ3) IC75.C7(VDD2) IC75.C9(VDDQ4) IC75.E2(VDDQ5) IC75.E8(VDDQ6) IC75.F1(VDD3) IC75.F9(VDD4) IC75.H1(VDD5) IC75.J9(VDD6) IC75.M1(VDD7) IC75.N9(VDD8) IC76.A1(VDD1) IC76.B2(VDDQ1) IC76.B8(VDDQ2) IC76.C1(VDDQ3) IC76.C7(VDD2) IC76.C9(VDDQ4) IC76.E2(VDDQ5) IC76.E8(VDDQ6) IC76.F1(VDD3) IC76.F9(VDD4) IC76.H1(VDD5) IC76.J9(VDD6) IC76.M1(VDD7) IC76.N9(VDD8) IC77.A1(VDD1) IC77.B2(VDDQ1) IC77.B8(VDDQ2) IC77.C1(VDDQ3) IC77.C7(VDD2) IC77.C9(VDDQ4) IC77.E2(VDDQ5) IC77.E8(VDDQ6) IC77.F1(VDD3) IC77.F9(VDD4) IC77.H1(VDD5) IC77.J9(VDD6) IC77.M1(VDD7) IC77.N9(VDD8) IC78.A1(VDD1) IC78.B2(VDDQ1) IC78.B8(VDDQ2) IC78.C1(VDDQ3) IC78.C7(VDD2) IC78.C9(VDDQ4) IC78.E2(VDDQ5) IC78.E8(VDDQ6) IC78.F1(VDD3) IC78.F9(VDD4) IC78.H1(VDD5) IC78.J9(VDD6) IC78.M1(VDD7) IC78.N9(VDD8) IC79.A1(VDD1) IC79.B2(VDDQ1) IC79.B8(VDDQ2) IC79.C1(VDDQ3) IC79.C7(VDD2) IC79.C9(VDDQ4) IC79.E2(VDDQ5) IC79.E8(VDDQ6) IC79.F1(VDD3) IC79.F9(VDD4) IC79.H1(VDD5) IC79.J9(VDD6) IC79.M1(VDD7) IC79.N9(VDD8) IC80.A1(VDD1) IC80.B2(VDDQ1) IC80.B8(VDDQ2) IC80.C1(VDDQ3) IC80.C7(VDD2) IC80.C9(VDDQ4) IC80.E2(VDDQ5) IC80.E8(VDDQ6) IC80.F1(VDD3) IC80.F9(VDD4) IC80.H1(VDD5) IC80.J9(VDD6) IC80.M1(VDD7) IC80.N9(VDD8) IC81.A1(VDD1) IC81.B2(VDDQ1) IC81.B8(VDDQ2) IC81.C1(VDDQ3) IC81.C7(VDD2) IC81.C9(VDDQ4) IC81.E2(VDDQ5) IC81.E8(VDDQ6) IC81.F1(VDD3) IC81.F9(VDD4) IC81.H1(VDD5) IC81.J9(VDD6) IC81.M1(VDD7) IC81.N9(VDD8) IC82.A1(VDD1) IC82.B2(VDDQ1) IC82.B8(VDDQ2) IC82.C1(VDDQ3) IC82.C7(VDD2) IC82.C9(VDDQ4) IC82.E2(VDDQ5) IC82.E8(VDDQ6) IC82.F1(VDD3) IC82.F9(VDD4) IC82.H1(VDD5) IC82.J9(VDD6) IC82.M1(VDD7) IC82.N9(VDD8) R671.1 R673.2 R676.1
DDR_VREF: C1120.2 C1121.2 C1122.2 C1123.2 C1124.2 C1125.2 C1126.2 C1127.2 C1137.2 C1138.2 C1139.2 C1140.2 C1141.2 C1142.2 C1143.2 C1144.2 IC75.J1(VREFCA) IC76.J1(VREFCA) IC77.J1(VREFCA) IC78.J1(VREFCA) IC79.J1(VREFCA) IC80.J1(VREFCA) IC81.J1(VREFCA) IC82.J1(VREFCA)
DDR_VTT: C1185.2 C1186.2 C1187.2 C1188.2 C1189.2 C1190.2 C1211.2 C1212.2 C1213.2 C1214.2 C1215.2 C1216.2 C1237.2 C1238.2 C1239.2 C1240.2 C1241.1 C1242.1 R683.2 R684.2 R685.2 R686.2 R687.2 R688.2 R689.2 R690.2 R691.2 R692.2 R693.2 R694.2 R695.2 R696.2 R697.2 R698.2 R699.2 R700.2 R701.2 R702.2 R703.2 R704.2 R705.2 R706.2 R707.2 R708.2 R709.2 R710.2 R711.2
GND: C1112.2 C1113.2 C1114.2 C1115.2 C1116.2 C1117.2 C1118.2 C1119.2 C1120.1 C1121.1 C1122.1 C1123.1 C1124.1 C1125.1 C1126.1 C1127.1 C1128.2 C1129.2 C1130.2 C1131.2 C1132.2 C1133.2 C1134.2 C1135.2 C1136.2 C1137.1 C1138.1 C1139.1 C1140.1 C1141.1 C1142.1 C1143.1 C1144.1 C1145.1 C1146.1 C1147.1 C1148.1 C1149.1 C1150.1 C1151.1 C1152.1 C1153.2 C1154.2 C1155.1 C1156.1 C1157.1 C1158.1 C1159.1 C1160.1 C1161.1 C1162.1 C1163.2 C1164.2 C1165.1 C1166.1 C1167.1 C1168.1 C1169.1 C1170.1 C1171.1 C1172.1 C1173.2 C1174.2 C1175.1 C1176.1 C1177.1 C1178.1 C1179.1 C1180.1 C1181.1 C1182.1 C1183.2 C1184.2 C1185.1 C1186.1 C1187.1 C1188.1 C1189.1 C1190.1 C1191.1 C1192.1 C1193.1 C1194.1 C1195.1 C1196.1 C1197.1 C1198.1 C1199.2 C1200.2 C1201.1 C1202.1 C1203.1 C1204.1 C1205.1 C1206.1 C1207.1 C1208.1 C1209.2 C1210.2 C1211.1 C1212.1 C1213.1 C1214.1 C1215.1 C1216.1 C1217.1 C1218.1 C1219.1 C1220.1 C1221.1 C1222.1 C1223.1 C1224.1 C1225.2 C1226.2 C1227.1 C1228.1 C1229.1 C1230.1 C1231.1 C1232.1 C1233.1 C1234.1 C1235.2 C1236.2 C1237.1 C1238.1 C1239.1 C1240.1 C1241.2 C1242.2 IC61.W24(D1_MCK1) IC61.W25(D1_MCK1#) IC75.A2(VSSQ1) IC75.A8(VSSQ2) IC75.A9(VSS1) IC75.C8(VSS2) IC75.D1(VSSQ3) IC75.D9(VSSQ4) IC75.E1(VSS3) IC75.E9(VSS4) IC75.G1(VSS5) IC75.H9(VSS6) IC75.K1(VSS7) IC75.K9(VSS8) IC75.N1(VSS9) IC76.A2(VSSQ1) IC76.A8(VSSQ2) IC76.A9(VSS1) IC76.C8(VSS2) IC76.D1(VSSQ3) IC76.D9(VSSQ4) IC76.E1(VSS3) IC76.E9(VSS4) IC76.G1(VSS5) IC76.H9(VSS6) IC76.K1(VSS7) IC76.K9(VSS8) IC76.N1(VSS9) IC77.A2(VSSQ1) IC77.A8(VSSQ2) IC77.A9(VSS1) IC77.C8(VSS2) IC77.D1(VSSQ3) IC77.D9(VSSQ4) IC77.E1(VSS3) IC77.E9(VSS4) IC77.G1(VSS5) IC77.H9(VSS6) IC77.K1(VSS7) IC77.K9(VSS8) IC77.N1(VSS9) IC78.A2(VSSQ1) IC78.A8(VSSQ2) IC78.A9(VSS1) IC78.C8(VSS2) IC78.D1(VSSQ3) IC78.D9(VSSQ4) IC78.E1(VSS3) IC78.E9(VSS4) IC78.G1(VSS5) IC78.H9(VSS6) IC78.K1(VSS7) IC78.K9(VSS8) IC78.N1(VSS9) IC79.A2(VSSQ1) IC79.A8(VSSQ2) IC79.A9(VSS1) IC79.C8(VSS2) IC79.D1(VSSQ3) IC79.D9(VSSQ4) IC79.E1(VSS3) IC79.E9(VSS4) IC79.G1(VSS5) IC79.H9(VSS6) IC79.K1(VSS7) IC79.K9(VSS8) IC79.N1(VSS9) IC80.A2(VSSQ1) IC80.A8(VSSQ2) IC80.A9(VSS1) IC80.C8(VSS2) IC80.D1(VSSQ3) IC80.D9(VSSQ4) IC80.E1(VSS3) IC80.E9(VSS4) IC80.G1(VSS5) IC80.H9(VSS6) IC80.K1(VSS7) IC80.K9(VSS8) IC80.N1(VSS9) IC81.A2(VSSQ1) IC81.A8(VSSQ2) IC81.A9(VSS1) IC81.C8(VSS2) IC81.D1(VSSQ3) IC81.D9(VSSQ4) IC81.E1(VSS3) IC81.E9(VSS4) IC81.G1(VSS5) IC81.H9(VSS6) IC81.K1(VSS7) IC81.K9(VSS8) IC81.N1(VSS9) IC82.A2(VSSQ1) IC82.A8(VSSQ2) IC82.A9(VSS1) IC82.C8(VSS2) IC82.D1(VSSQ3) IC82.D9(VSSQ4) IC82.E1(VSS3) IC82.E9(VSS4) IC82.G1(VSS5) IC82.H9(VSS6) IC82.K1(VSS7) IC82.K9(VSS8) IC82.N1(VSS9) IC83.1(NC) IC83.3(A2) IC83.4(GND) R667.1 R668.1 R669.1 R670.1 R672.1 R675.1 R677.2 R678.1 R679.1 R680.1 R681.1 R682.1
SE_ALERT_N: IC75.L9(~{ALERT}) IC76.L9(~{ALERT}) IC77.L9(~{ALERT}) IC78.L9(~{ALERT}) IC79.L9(~{ALERT}) IC80.L9(~{ALERT}) IC81.L9(~{ALERT}) IC82.L9(~{ALERT}) R674.2
SE_DDR4_A0: IC75.L3(A0) IC76.L3(A0) IC77.L3(A0) IC78.L3(A0) IC79.L3(A0) IC80.L3(A0) IC81.L3(A0) IC82.L3(A0) R686.1
SE_DDR4_A1: IC61.AA21(D1_MA01) IC75.L7(A1) IC76.L7(A1) IC77.L7(A1) IC78.L7(A1) IC79.L7(A1) IC80.L7(A1) IC81.L7(A1) IC82.L7(A1) R687.1
SE_DDR4_A2: IC61.V23(D1_MA02) IC75.M3(A2) IC76.M3(A2) IC77.M3(A2) IC78.M3(A2) IC79.M3(A2) IC80.M3(A2) IC81.M3(A2) IC82.M3(A2) R688.1
SE_DDR4_A3: IC61.AD23(D1_MA03) IC75.K7(A3) IC76.K7(A3) IC77.K7(A3) IC78.K7(A3) IC79.K7(A3) IC80.K7(A3) IC81.K7(A3) IC82.K7(A3) R689.1
SE_DDR4_A4: IC61.AA23(D1_MA04) IC75.K3(A4) IC76.K3(A4) IC77.K3(A4) IC78.K3(A4) IC79.K3(A4) IC80.K3(A4) IC81.K3(A4) IC82.K3(A4) R690.1
SE_DDR4_A5: IC61.W23(D1_MA05) IC75.L8(A5) IC76.L8(A5) IC77.L8(A5) IC78.L8(A5) IC79.L8(A5) IC80.L8(A5) IC81.L8(A5) IC82.L8(A5) R691.1
SE_DDR4_A6: IC61.AC24(D1_MA06) IC75.L2(A6) IC76.L2(A6) IC77.L2(A6) IC78.L2(A6) IC79.L2(A6) IC80.L2(A6) IC81.L2(A6) IC82.L2(A6) R692.1
SE_DDR4_A7: IC61.U24(D1_MA07) IC75.M8(A7) IC76.M8(A7) IC77.M8(A7) IC78.M8(A7) IC79.M8(A7) IC80.M8(A7) IC81.M8(A7) IC82.M8(A7) R693.1
SE_DDR4_A8: IC61.R22(D1_MA08) IC75.M2(A8) IC76.M2(A8) IC77.M2(A8) IC78.M2(A8) IC79.M2(A8) IC80.M2(A8) IC81.M2(A8) IC82.M2(A8) R694.1
SE_DDR4_A9: IC61.W22(D1_MA09) IC75.M7(A9) IC76.M7(A9) IC77.M7(A9) IC78.M7(A9) IC79.M7(A9) IC80.M7(A9) IC81.M7(A9) IC82.M7(A9) R695.1
SE_DDR4_A10: IC61.AB23(D1_MA10) IC75.J3(A10/AP) IC76.J3(A10/AP) IC77.J3(A10/AP) IC78.J3(A10/AP) IC79.J3(A10/AP) IC80.J3(A10/AP) IC81.J3(A10/AP) IC82.J3(A10/AP) R696.1
SE_DDR4_A11: IC61.T23(D1_MA11) IC75.N2(A11) IC76.N2(A11) IC77.N2(A11) IC78.N2(A11) IC79.N2(A11) IC80.N2(A11) IC81.N2(A11) IC82.N2(A11) R697.1
SE_DDR4_A12: IC61.AC23(D1_MA12) IC75.J7(A12/~{BC}) IC76.J7(A12/~{BC}) IC77.J7(A12/~{BC}) IC78.J7(A12/~{BC}) IC79.J7(A12/~{BC}) IC80.J7(A12/~{BC}) IC81.J7(A12/~{BC}) IC82.J7(A12/~{BC}) R698.1
SE_DDR4_A13: IC61.T25(D1_MA13) IC75.N8(A13) IC76.N8(A13) IC77.N8(A13) IC78.N8(A13) IC79.N8(A13) IC80.N8(A13) IC81.N8(A13) IC82.N8(A13) R699.1
SE_DDR4_A14: IC61.AE22(D1_MA14) IC75.J8(BG1) IC76.J8(BG1) IC77.J8(BG1) IC78.J8(BG1) IC79.J8(BG1) IC80.J8(BG1) IC81.J8(BG1) IC82.J8(BG1) R700.1
SE_DDR4_A15: IC61.U21(D1_MA15) IC75.H3(~{ACT}) IC76.H3(~{ACT}) IC77.H3(~{ACT}) IC78.H3(~{ACT}) IC79.H3(~{ACT}) IC80.H3(~{ACT}) IC81.H3(~{ACT}) IC82.H3(~{ACT}) R701.1
SE_DDR4_ARAS_B: IC61.AB25(D1_MRAS#)
SE_DDR4_BA0: IC61.AC21(D1_MBA0) IC75.K2(BA0) IC76.K2(BA0) IC77.K2(BA0) IC78.K2(BA0) IC79.K2(BA0) IC80.K2(BA0) IC81.K2(BA0) IC82.K2(BA0) R683.1
SE_DDR4_BA1: IC61.Y23(D1_MBA1) IC75.K8(BA1) IC76.K8(BA1) IC77.K8(BA1) IC78.K8(BA1) IC79.K8(BA1) IC80.K8(BA1) IC81.K8(BA1) IC82.K8(BA1) R684.1
SE_DDR4_BA2: IC75.J2(BG0) IC76.J2(BG0) IC77.J2(BG0) IC78.J2(BG0) IC79.J2(BG0) IC80.J2(BG0) IC81.J2(BG0) IC82.J2(BG0) R685.1
SE_DDR4_CAS_B: IC61.AC22(D1_MCAS#) IC75.H7(~{CAS}/A15) IC76.H7(~{CAS}/A15) IC77.H7(~{CAS}/A15) IC78.H7(~{CAS}/A15) IC79.H7(~{CAS}/A15) IC80.H7(~{CAS}/A15) IC81.H7(~{CAS}/A15) IC82.H7(~{CAS}/A15) R703.1
SE_DDR4_CKE0: IC61.W21(D1_MCKE0) IC75.G3(CKE) IC76.G3(CKE) IC77.G3(CKE) IC78.G3(CKE) IC79.G3(CKE) IC80.G3(CKE) IC81.G3(CKE) IC82.G3(CKE) R706.1
SE_DDR4_CKE1: IC61.AB21(D1_MCKE1) IC75.G2(C0/CKE1) IC76.G2(C0/CKE1) IC77.G2(C0/CKE1) IC78.G2(C0/CKE1) IC79.G2(C0/CKE1) IC80.G2(C0/CKE1) IC81.G2(C0/CKE1) IC82.G2(C0/CKE1) R709.1
SE_DDR4_CLK: IC61.AA24(D1_MCK0) IC75.F7(CK_T) IC76.F7(CK_T) IC77.F7(CK_T) IC78.F7(CK_T) IC79.F7(CK_T) IC80.F7(CK_T) IC81.F7(CK_T) IC82.F7(CK_T)
SE_DDR4_CLK_B: IC61.AA25(D1_MCK0#) IC75.F8(CK_C) IC76.F8(CK_C) IC77.F8(CK_C) IC78.F8(CK_C) IC79.F8(CK_C) IC80.F8(CK_C) IC81.F8(CK_C) IC82.F8(CK_C)
SE_DDR4_CS0_B: IC61.U23(D1_MCS0#) IC75.G7(~{CS}) IC76.G7(~{CS}) IC77.G7(~{CS}) IC78.G7(~{CS}) IC79.G7(~{CS}) IC80.G7(~{CS}) IC81.G7(~{CS}) IC82.G7(~{CS}) R705.1
SE_DDR4_CS1_B: IC61.V21(D1_MCS1#) IC75.G8(C1/~{CS1}) IC76.G8(C1/~{CS1}) IC77.G8(C1/~{CS1}) IC78.G8(C1/~{CS1}) IC79.G8(C1/~{CS1}) IC80.G8(C1/~{CS1}) IC81.G8(C1/~{CS1}) IC82.G8(C1/~{CS1}) R708.1
SE_DDR4_DM0_B: IC75.A7(NF/~{DM}/~{DBI}/TDQS_T) IC76.A7(NF/~{DM}/~{DBI}/TDQS_T) IC77.A7(NF/~{DM}/~{DBI}/TDQS_T) IC78.A7(NF/~{DM}/~{DBI}/TDQS_T) IC79.A7(NF/~{DM}/~{DBI}/TDQS_T) IC80.A7(NF/~{DM}/~{DBI}/TDQS_T) IC81.A7(NF/~{DM}/~{DBI}/TDQS_T) IC82.A7(NF/~{DM}/~{DBI}/TDQS_T)
SE_DDR4_DM8_B: IC61.B22(D1_MDM8)
SE_DDR4_DQ0: IC61.N24(D1_MDQ02) IC75.C2(DQ0) IC76.C2(DQ0) IC77.C2(DQ0) IC78.C2(DQ0) IC79.C2(DQ0) IC80.C2(DQ0) IC81.C2(DQ0) IC82.C2(DQ0)
SE_DDR4_DQ1: IC61.K24(D1_MDQ01) IC75.B7(DQ1) IC76.B7(DQ1) IC77.B7(DQ1) IC78.B7(DQ1) IC79.B7(DQ1) IC80.B7(DQ1) IC81.B7(DQ1) IC82.B7(DQ1)
SE_DDR4_DQ2: IC61.R24(D1_MDQ03) IC75.D3(DQ2) IC76.D3(DQ2) IC77.D3(DQ2) IC78.D3(DQ2) IC79.D3(DQ2) IC80.D3(DQ2) IC81.D3(DQ2) IC82.D3(DQ2)
SE_DDR4_DQ3: IC61.J25(D1_MDQ00) IC75.D7(DQ3) IC76.D7(DQ3) IC77.D7(DQ3) IC78.D7(DQ3) IC79.D7(DQ3) IC80.D7(DQ3) IC81.D7(DQ3) IC82.D7(DQ3)
SE_DDR4_DQ4: IC61.P25(D1_MDQ07) IC75.D2(DQ4/NC) IC76.D2(DQ4/NC) IC77.D2(DQ4/NC) IC78.D2(DQ4/NC) IC79.D2(DQ4/NC) IC80.D2(DQ4/NC) IC81.D2(DQ4/NC) IC82.D2(DQ4/NC)
SE_DDR4_DQ5: IC61.K25(D1_MDQ05) IC75.D8(DQ5/NC) IC76.D8(DQ5/NC) IC77.D8(DQ5/NC) IC78.D8(DQ5/NC) IC79.D8(DQ5/NC) IC80.D8(DQ5/NC) IC81.D8(DQ5/NC) IC82.D8(DQ5/NC)
SE_DDR4_DQ6: IC61.N25(D1_MDQ06) IC75.E3(DQ6/NC) IC76.E3(DQ6/NC) IC77.E3(DQ6/NC) IC78.E3(DQ6/NC) IC79.E3(DQ6/NC) IC80.E3(DQ6/NC) IC81.E3(DQ6/NC) IC82.E3(DQ6/NC)
SE_DDR4_DQ7: IC61.H24(D1_MDQ04) IC75.E7(DQ7/NC) IC76.E7(DQ7/NC) IC77.E7(DQ7/NC) IC78.E7(DQ7/NC) IC79.E7(DQ7/NC) IC80.E7(DQ7/NC) IC81.E7(DQ7/NC) IC82.E7(DQ7/NC)
SE_DDR4_DQ8: IC61.N21(D1_MDQ10)
SE_DDR4_DQ9: IC61.M23(D1_MDQ09)
SE_DDR4_DQ10: IC61.P21(D1_MDQ11)
SE_DDR4_DQ11: IC61.L23(D1_MDQ08)
SE_DDR4_DQ12: IC61.M21(D1_MDQ14)
SE_DDR4_DQ13: IC61.L22(D1_MDQ13)
SE_DDR4_DQ14: IC61.P23(D1_MDQ15)
SE_DDR4_DQ15: IC61.K21(D1_MDQ12)
SE_DDR4_DQ16: IC61.F24(D1_MDQ18)
SE_DDR4_DQ17: IC61.C25(D1_MDQ17)
SE_DDR4_DQ18: IC61.H25(D1_MDQ19)
SE_DDR4_DQ19: IC61.C24(D1_MDQ16)
SE_DDR4_DQ20: IC61.G25(D1_MDQ23)
SE_DDR4_DQ22: IC61.F25(D1_MDQ22)
SE_DDR4_DQ24: IC61.K23(D1_MDQ27)
SE_DDR4_DQ25: IC61.H21(D1_MDQ25)
SE_DDR4_DQ26: IC61.J23(D1_MDQ26)
SE_DDR4_DQ27: IC61.F22(D1_MDQ24)
SE_DDR4_DQ28: IC61.J22(D1_MDQ31)
SE_DDR4_DQ29: IC61.F23(D1_MDQ29)
SE_DDR4_DQ30: IC61.J21(D1_MDQ30)
SE_DDR4_DQ31: IC61.G21(D1_MDQ28)
SE_DDR4_DQS0: IC61.M24(D1_MDQS0) IC75.C3(DQS_T) IC76.C3(DQS_T) IC77.C3(DQS_T) IC78.C3(DQS_T) IC79.C3(DQS_T) IC80.C3(DQS_T) IC81.C3(DQS_T) IC82.C3(DQS_T)
SE_DDR4_DQS0_B: IC75.B3(DQS_S) IC76.B3(DQS_S) IC77.B3(DQS_S) IC78.B3(DQS_S) IC79.B3(DQS_S) IC80.B3(DQS_S) IC81.B3(DQS_S) IC82.B3(DQS_S)
SE_DDR4_DQS1: IC61.N22(D1_MDQS1)
SE_DDR4_DQS1_B: IC61.N23(D1_MDQS1#)
SE_DDR4_DQS2_B: IC61.D25(D1_MDQS2#)
SE_DDR4_DQS3: IC61.H23(D1_MDQS3)
SE_DDR4_DQS3_B: IC61.H22(D1_MDQS3#)
SE_DDR4_DQS8: IC61.B23(D1_MDQS8)
SE_DDR4_DQS8_B: IC61.A23(D1_MDQS8#)
SE_DDR4_MECC0: IC61.C22(D1_MECC0)
SE_DDR4_MECC1: IC61.A22(D1_MECC1)
SE_DDR4_MECC2: IC61.D22(D1_MECC2)
SE_DDR4_MECC3: IC61.D23(D1_MECC3)
SE_DDR4_OD1: IC61.T21(D1_MODT1)
SE_DDR4_ODT0: IC61.U22(D1_MODT0) IC75.F3(ODT) IC76.F3(ODT) IC77.F3(ODT) IC78.F3(ODT) IC79.F3(ODT) IC80.F3(ODT) IC81.F3(ODT) IC82.F3(ODT) R707.1
SE_DDR4_ODT1: IC75.F2(ODT1) IC76.F2(ODT1) IC77.F2(ODT1) IC78.F2(ODT1) IC79.F2(ODT1) IC80.F2(ODT1) IC81.F2(ODT1) IC82.F2(ODT1) R710.1
SE_DDR4_PAR: IC61.U25(D1_MAPAR_OUT) IC75.N3(PAR) IC76.N3(PAR) IC77.N3(PAR) IC78.N3(PAR) IC79.N3(PAR) IC80.N3(PAR) IC81.N3(PAR) IC82.N3(PAR) R711.1
SE_DDR4_RAS_B: IC75.H8(~{RAS}/A16/NC) IC76.H8(~{RAS}/A16/NC) IC77.H8(~{RAS}/A16/NC) IC78.H8(~{RAS}/A16/NC) IC79.H8(~{RAS}/A16/NC) IC80.H8(~{RAS}/A16/NC) IC81.H8(~{RAS}/A16/NC) IC82.H8(~{RAS}/A16/NC) R702.1
SE_DDR4_RST_B: IC75.L1(~{RESET}) IC76.L1(~{RESET}) IC77.L1(~{RESET}) IC78.L1(~{RESET}) IC79.L1(~{RESET}) IC80.L1(~{RESET}) IC81.L1(~{RESET}) IC82.L1(~{RESET})
SE_DDR4_TEN: IC75.G9(RUF/TEN) IC76.G9(RUF/TEN) IC77.G9(RUF/TEN) IC78.G9(RUF/TEN) IC79.G9(RUF/TEN) IC80.G9(RUF/TEN) IC81.G9(RUF/TEN) IC82.G9(RUF/TEN) R677.1
SE_DDR4_WE_B: IC75.H2(~{WE}/A14) IC76.H2(~{WE}/A14) IC77.H2(~{WE}/A14) IC78.H2(~{WE}/A14) IC79.H2(~{WE}/A14) IC80.H2(~{WE}/A14) IC81.H2(~{WE}/A14) IC82.H2(~{WE}/A14) R704.1
SE_DDR4_ZQ_0: IC75.B9(ZQ) IC76.B9(ZQ) IC77.B9(ZQ) IC78.B9(ZQ) IC79.B9(ZQ) IC80.B9(ZQ) IC81.B9(ZQ) IC82.B9(ZQ) R667.2 R668.2 R669.2 R670.2 R678.2 R679.2 R680.2 R681.2
SE_DDR_RST_B: R676.2
SE_I2C1_SCL: IC83.6(SCL)
SE_I2C1_SDA: IC83.5(SDA)
NetIC61_AD24: IC61.AD24(D1_MAPAR_ERR#) R673.1 R674.1
NetIC61_V25: IC61.V25(D1_MDIC0) R672.2
NetIC61_Y25: IC61.Y25(D1_MDIC1) R671.2
NetIC83_7: IC83.7(WP) R682.2

Not connected (* = marked no-connect by the designer): IC61 AA22(D1_MCS3#) AB20(D1_MCS2#)* AC25(D1_MA00) AE23(D1_MBA2) B24(D1_MDQ20) D1(D1_TPA) D24(D1_MDQ21) E23(D1_MDM2) E25(D1_MDQS2) G23(D1_MDM4) H19(D1_MVREF) L21(D1_MDM1) L25(D1_MDM0) M25(D1_MDQS0#) Y21(D1_MWE); IC75 A3(NF/TDQS_C)* N7(A17/NC)*; IC76 A3(NF/TDQS_C)* N7(A17/NC)*; IC77 A3(NF/TDQS_C)* N7(A17/NC)*; IC78 A3(NF/TDQS_C)* N7(A17/NC)*; IC79 A3(NF/TDQS_C)* N7(A17/NC)*; IC80 A3(NF/TDQS_C)* N7(A17/NC)*; IC81 A3(NF/TDQS_C)* N7(A17/NC)*; IC82 A3(NF/TDQS_C)* N7(A17/NC)*; R675 2

### Notes on the sheet
- Title
- Size:
- Date:
- File:
- D
- Number:
- Time:
- Revision:
- Sheet
- of
- (in symbol LS1043ASN8QQB, part A) DDR; 1 OF 16

### Library data of the parts
C1112-C1119 C1128-C1135 = CMP-2008-04556-2: CAP CER 1UF 10V X5R 0402; Manufacturer Part Number: GRM155R61A105KE15D; Manufacturer: Murata; Material: Ceramic; Tolerance: 10%; Temperature Coefficient: 15%; Octopart: https://octopart.com/grm155r61a105ke15d-murata-197442; Lead Free: Yes; ComponentLink2Description: Datasheet; Temperature: -55°C to +85°C; Temperature Range High: +85°C; Height: 0.55mm; Capacitance: 1uF; Ipc Land Pattern Name: CAPC10050X50; ComponentLink2URL: https://search.murata.co.jp/Ceramy/image/img/A01X/G101/ENG/GRM155R61A105KE15-01A.pdf; Temperature Range Low: -55°C; Device Class L2: Capacitors; Voltage Rating: 10V; RoHS: TRUE; Device Class L1: Passive Components; Device Class L3: Ceramic Capacitors; Temperature Characteristic: X5R; Mouser Description: 0402 1 uF 10 V ±10% Tolerance X5R Surface Mount Multilayer Ceramic Capacitor; Automotive: No; Package: GRM15-0.1; Digikey Description: CAP CER 1UF 10V X5R 0402; Value: 1uF; Category: Cap
C1120-C1123 C1136-C1140 C1145-C1152 C1155-C1162 C1165-C1172 C1175-C1182 C1185-C1198 C1201-C1208 C1211-C1224 C1227-C1234 C1237-C1240 = CMP-2100-03641-2: as C1078 on sheet Server_CPU_Reset_IO; RoHS: TRUE; Temperature Characteristic: X7R; Octopart: https://octopart.com/grm155r71c104ka88d-murata-196880; Digikey Description: CAP CER 0.1UF 16V X7R 0402; Device Class L3: Ceramic Capacitors; Height: 0.55mm; ComponentLink2Description: Datasheet; Temperature Range Low: -55°C; Ipc Land Pattern Name: CAPC10050X219; ComponentLink2URL: https://search.murata.co.jp/Ceramy/image/img/A01X/G101/ENG/GRM155R71H471KA01-01A.pdf; Device Class L1: Passive Components; Lead Free: yes; Category: Cap; Package: GRM15; Temperature: -55°C to +125°C; Device Class L2: Capacitors; Temperature Range High: +125°C; Mouser Description: 0402 0.1 uF 16V ±10 % Tolerance X7R SMT Multilayer Ceramic Capacitor
C1124-C1127 C1141-C1144 = CMP-2008-02796-1: as C1085 on sheet Server_CPU_Reset_IO
C1153 C1154 C1163 C1164 C1173 C1174 C1183 C1184 C1199 C1200 C1209 C1210 C1225 C1226 C1235 C1236 C1241 = CMP-2007-03453-2: Chip Multilayer Ceramic Capacitors for General Purpose, 0805, 10uF, X5R, 15%, 10%, 16V; Radiation Hardening: No; Thickness: 0.053inch; Voltage Rating (DC): 16V; Lead Free: Lead Free; Package Quantity: 1; Width: 1.25mm; Case Code (Imperial): 0805; Depth: 1.25mm; Packaging: Tape and Reel; Dielectric: X5R; Max Operating Temperature: 85°C; Tolerance: 10%; Voltage Rating: 16V; Voltage: 16V; Capacitance: 10uF; Height: 1.25mm; Case Code (Metric): 2012; Material: Ceramic; Mount: Surface Mount; Case/Package: 0805; REACH SVHC: No SVHC; Length: 2mm; Min Operating Temperature: -55°C; Termination: SMD/SMT
C1242 = CMP-2008-04549-2: as C1096 on sheet Server_CPU_USB; Height: 0.5mm; Weight: 0.000212oz; Length: 1mm; Case Code (Metric): 1005; Packaging: Tape and Reel; Termination: SMD/SMT; Dielectric: X5R; Depth: 0.5mm; Case Code (Imperial): 0402; Min Operating Temperature: -55°C; Case/Package: 0402; Voltage: 6.3V; Width: 0.02inch; Capacitance: 4.7uF; Lead Free: Lead Free; Thickness: 0.022inch; Contact Plating: Tin; REACH SVHC: No SVHC; Package Quantity: 10000; Tolerance: 20%; Voltage Rating (DC): 6.3V; Voltage Rating: 6.3V; Mount: Surface Mount; Max Operating Temperature: 85°C
IC61 = LS1043ASN8QQB: as IC61 on sheet Server_CPU_Reset_IO; Datasheet Link: http://www.nxp.com/secured/assets/documents/en/data-sheet/LS1088A.pdf; Height: 2.61mm; Manufacturer_Part_Number: LS1043ASN8QQB; Mouser Part Number: 771-LS1043ASN8QQB; Mouser Price/Stock: https://www.mouser.co.uk/ProductDetail/NXP-Semiconductors/LS1043ASN8QQB/?qs=AQlKX63v8RsTATOTx7X0Jg%3D%3D
IC75-IC82 = MT40A512M8SA-062E_F_TR: Integrated Circuit; Manufacturer_Name: Micron; Manufacturer_Part_Number: MT40A512M8SA-062E:F TR; Datasheet Link: https://componentsearchengine.com/Datasheets/1/MT40A512M8SA-062E_F TR.pdf; Height: 1.2mm; Mouser Part Number: 340-402508-REEL; Mouser Price/Stock: https://www.mouser.co.uk/ProductDetail/Micron/MT40A512M8SA-062EF-TR?qs=B6kkDfuK7%2FBF%2FgRBWVz2BQ%3D%3D
IC83 = AT24C04C-SSHM-T: Integrated Circuit; Manufacturer_Name: Microchip; Datasheet Link: https://datasheet.lcsc.com/szlcsc/Microchip-Tech-AT24C04C-SSHM-T_C6205.pdf; Height: 1.75mm; Manufacturer_Part_Number: AT24C04C-SSHM-T; Mouser Part Number: 556-AT24C04C-SSHM-T; Mouser Price/Stock: https://www.mouser.co.uk/ProductDetail/Microchip-Technology-Atmel/AT24C04C-SSHM-T?qs=rNaVQffb%252BtcPg4SMgvVriA%3D%3D; Arrow Part Number: AT24C04C-SSHM-T; Arrow Price/Stock: https://www.arrow.com/en/products/at24c04c-sshm-t/microchip-technology
R667-R670 R678-R681 = CMP-2002-08397-1: Manufacturer: Vishay Dale; Part Number: CRCW0402240RFKED
R671 R672 = CMP-2002-08231-1: Part Number: CRCW0402162RFKED; Manufacturer: Vishay Dale
R673 = CMP-2002-00051-3: as R554-R556 on sheet Server_CPU_Reset_IO; Termination: SMD/SMT; Military Standard: Not; Length: 1mm; Radiation Hardening: No; Max Operating Temperature: 155°C; Min Operating Temperature: -55°C; Package Quantity: 10; Width: 0.5mm; Case Code (Imperial): 0402; Number of Terminations: 2; Max Power Dissipation: 63mW; Tolerance: 1%; Features: Automotive AEC-Q200; Composition: Thick Film; Depth: 0.5mm; Mount: Surface Mount; Weight: 2.3E-05oz; Lead Free: Lead Free; Case/Package: 0402; Height: 0.35mm; Packaging: Tape and Reel; Temperature Coefficient: 100ppm/°C; Case Code (Metric): 1005; Voltage Rating: 50V; Contact Plating: Tin
R674 R675 = CMP-2002-08122-2: as R553 on sheet Server_CPU_Reset_IO; Contact Plating: Tin; Height: 0.35mm; Radiation Hardening: No; Features: Automotive AEC-Q200; Composition: Thick Film; Width: 0.5mm; Weight: 2.3E-05oz; Termination: SMD/SMT; Packaging: Tape and Reel; Mount: Surface Mount; Case Code (Metric): 1005; Military Standard: Not; Min Operating Temperature: -55°C; Number of Terminations: 2; Package Quantity: 1; Case Code (Imperial): 0402; Depth: 0.5mm; Max Operating Temperature: 155°C; Case/Package: 0402; Power Rating: 63mW; Lead Free: Lead Free; Voltage Rating (DC): 50V; Length: 1mm
R676 R677 R682 = CMP-2002-01154-4: as R576-R578 on sheet Server_CPU_Reset_IO; Height: 0.35 mm; Mounting Technology: Surface Mount; REACH SVHC: Yes; Resistance: 4.7 KOhm; Max Operating Temperature: 155 degC; ComponentLink1Description: Manufacturer URL; ComponentLink2Description: Datasheet; Pins: 2; PackageReference: 0402; Tolerance: 1%; Case Code (Imperial): 0402; Length: 1 mm; PackageDescription: 2-Pin Surface Mount Device, Body 1 x 0.5 mm; RoHSCompliant: true; Package Quantity: 1; Radiation Hardening: No; DatasheetVersion: 04/2015; Width: 0.5 mm; Case Code (Metric): 1005; Mount: Surface Mount; ComponentLink1URL: http://www.panasonic.com/; Min Operating Temperature: -55 degC; Packaging: Cut Tape; ComponentLink2URL: http://industrial.panasonic.com/cdbs/www-data/pdf/RDA0000/AOA0000C86.pdf
R683-R711 = CMP-2002-00915-1: Part Number: ERJ2RKF39R0X; Manufacturer: Panasonic

## Sheet Server_CPU_RGMII.SchDoc
size D
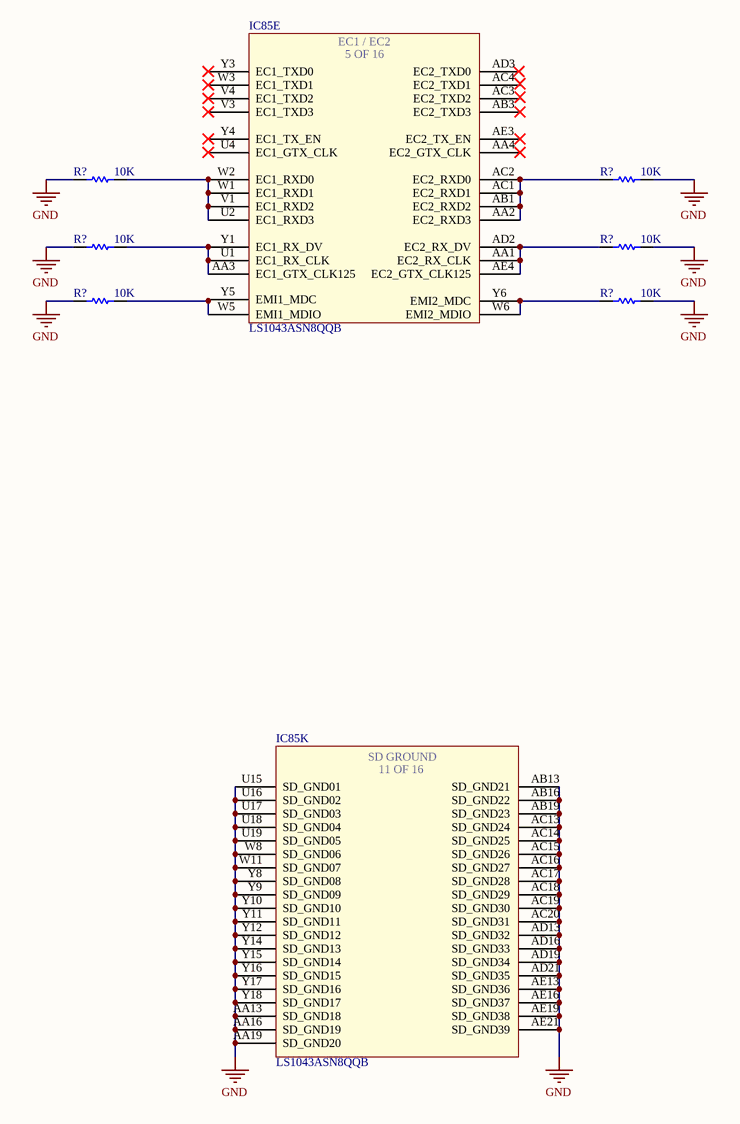
[diagram p63: Server_CPU_RGMII.SchDoc]

### Parts
(Parts that share a designator on the sheet are numbered #1, #2 ... from top to bottom, then left to right.)
IC85  LS1043ASN8QQB  [BGA780C80P28X28_2300X2300X261]  (parts E,K of 16)
R?#23  10K  [RESC1005X40X25LL05T10]
R?#24  10K  [RESC1005X40X25LL05T10]
R?#25  10K  [RESC1005X40X25LL05T10]
R?#26  10K  [RESC1005X40X25LL05T10]
R?#27  10K  [RESC1005X40X25LL05T10]
R?#28  10K  [RESC1005X40X25LL05T10]

### Nets
GND: IC85.AA13(SD_GND18) IC85.AA16(SD_GND19) IC85.AA19(SD_GND20) IC85.AB13(SD_GND21) IC85.AB16(SD_GND22) IC85.AB19(SD_GND23) IC85.AC13(SD_GND24) IC85.AC14(SD_GND25) IC85.AC15(SD_GND26) IC85.AC16(SD_GND27) IC85.AC17(SD_GND28) IC85.AC18(SD_GND29) IC85.AC19(SD_GND30) IC85.AC20(SD_GND31) IC85.AD13(SD_GND32) IC85.AD16(SD_GND33) IC85.AD19(SD_GND34) IC85.AD21(SD_GND35) IC85.AE13(SD_GND36) IC85.AE16(SD_GND37) IC85.AE19(SD_GND38) IC85.AE21(SD_GND39) IC85.U15(SD_GND01) IC85.U16(SD_GND02) IC85.U17(SD_GND03) IC85.U18(SD_GND04) IC85.U19(SD_GND05) IC85.W8(SD_GND06) IC85.W11(SD_GND07) IC85.Y8(SD_GND08) IC85.Y9(SD_GND09) IC85.Y10(SD_GND10) IC85.Y11(SD_GND11) IC85.Y12(SD_GND12) IC85.Y14(SD_GND13) IC85.Y15(SD_GND14) IC85.Y16(SD_GND15) IC85.Y17(SD_GND16) IC85.Y18(SD_GND17) R?#23.1 R?#24.2 R?#25.1 R?#26.2 R?#27.1 R?#28.2
NetIC85_AA1: IC85.AA1(EC2_RX_CLK) IC85.AD2(EC2_RX_DV) IC85.AE4(EC2_GTX_CLK125) R?#26.1
NetIC85_AA2: IC85.AA2(EC2_RXD3) IC85.AB1(EC2_RXD2) IC85.AC1(EC2_RXD1) IC85.AC2(EC2_RXD0) R?#24.1
NetIC85_AA3: IC85.AA3(EC1_GTX_CLK125) IC85.U1(EC1_RX_CLK) IC85.Y1(EC1_RX_DV) R?#25.2
NetIC85_U2: IC85.U2(EC1_RXD3) IC85.V1(EC1_RXD2) IC85.W1(EC1_RXD1) IC85.W2(EC1_RXD0) R?#23.2
NetIC85_W5: IC85.W5(EMI1_MDIO) IC85.Y5(EMI1_MDC) R?#27.2
NetIC85_W6: IC85.W6(EMI2_MDIO) IC85.Y6(EMI2_MDC) R?#28.1

Not connected (* = marked no-connect by the designer): IC85 AA4(EC2_GTX_CLK)* AB3(EC2_TXD3)* AC3(EC2_TXD2) AC4(EC2_TXD1) AD3(EC2_TXD0) AE3(EC2_TX_EN)* U4(EC1_GTX_CLK)* V3(EC1_TXD3)* V4(EC1_TXD2)* W3(EC1_TXD1)* Y3(EC1_TXD0)* Y4(EC1_TX_EN)*

### Notes on the sheet
- Title
- Size:
- Date:
- File:
- D
- Number:
- Time:
- Revision:
- Sheet
- of
- (in symbol LS1043ASN8QQB, part E) EC1 / EC2; 5 OF 16
- (in symbol LS1043ASN8QQB, part K) SD GROUND; 11 OF 16

### Library data of the parts
IC85 = LS1043ASN8QQB: as IC61 on sheet Server_CPU_Reset_IO; Datasheet Link: http://www.nxp.com/secured/assets/documents/en/data-sheet/LS1088A.pdf; Height: 2.61mm; Manufacturer_Part_Number: LS1043ASN8QQB; Mouser Part Number: 771-LS1043ASN8QQB; Mouser Price/Stock: https://www.mouser.co.uk/ProductDetail/NXP-Semiconductors/LS1043ASN8QQB/?qs=AQlKX63v8RsTATOTx7X0Jg%3D%3D
R?#23-R?#28 = CMP-2002-07353-1: as R662-R665 on sheet Server_CPU_USB